# Altium project TIK_HandheldDevice.PrjPcb (part 2 of 2)

## Sheet signal_conditioning_circuit.SchDoc: Piezoelectric sensors conditioning circuit
size A4; Date: 2022-07-29; Author: Juan Del Pino Mena; Revision: 0.6; SheetNumber: 16; SheetTotal: 20; TitleBig: Piezoelectric sensors conditioning circuit; Desc_line1: Two analog signals come from two piezoelectric sensors nailed into a tree or trunk. The way piezos work force us to; Desc_line2: use this circuit to convert charge into voltage. The piezo sensors used generated upto -100 V peak, so it needs clipping
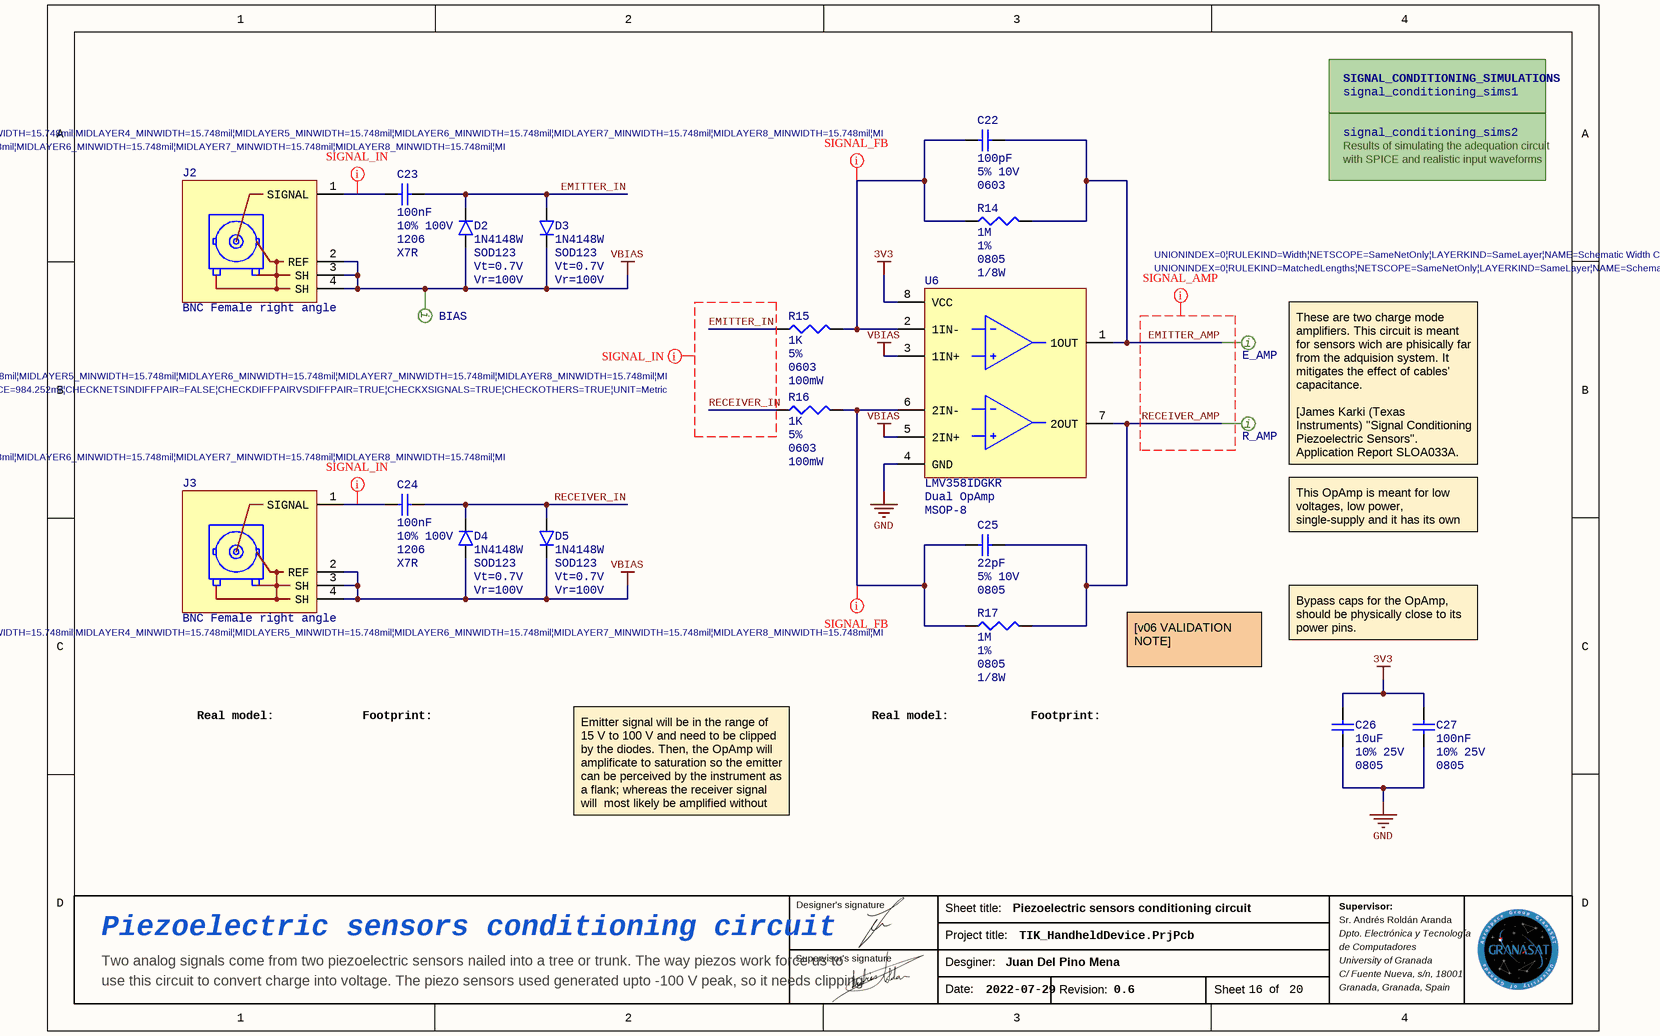
[diagram p9: signal_conditioning_circuit.SchDoc]

### Parts
BIAS  Test Point Pad dual sided  [TEST POINT PAD]  (value not drawn)  (no BOM)
C22  value 100pF  Tolerance: 5% 10V  PackageDescription: 0603  [CAP 0603_1608]  (hidden comment: Cap_cer_0603_100pF_5%)
C23  value 100nF  Tolerance: 10% 100V  PackageDescription: 1206  Type: X7R  [CAP 1206_3216]  (hidden comment: Cap_cer_0805)
C24  value 100nF  Tolerance: 10% 100V  PackageDescription: 1206  Type: X7R  [CAP 1206_3216]  (hidden comment: Cap_cer_0805)
C25  value 22pF  Tolerance: 5% 10V  PackageDescription: 0805  [CAP 0603_1608]  (hidden comment: Cap_cer_0603_22pF_5%)
C26  value 10uF  Tolerance: 10% 25V  PackageDescription: 0805  [CAP 0805_2012]  (hidden comment: Cap_cer_0805)
C27  value 100nF  Tolerance: 10% 25V  PackageDescription: 0805  [CAP 0805_2012]  (hidden comment: Cap_cer_0805)
D2  Part: 1N4148W  PackageDescription: SOD123  ForwardVoltage: Vt=0.7V  ReverseVoltage: Vr=100V  [SOD123F 1N4148W]  (hidden comment: Diode 1N4148W)
D3  Part: 1N4148W  PackageDescription: SOD123  ForwardVoltage: Vt=0.7V  ReverseVoltage: Vr=100V  [SOD123F 1N4148W]  (hidden comment: Diode 1N4148W)
D4  Part: 1N4148W  PackageDescription: SOD123  ForwardVoltage: Vt=0.7V  ReverseVoltage: Vr=100V  [SOD123F 1N4148W]  (hidden comment: Diode 1N4148W)
D5  Part: 1N4148W  PackageDescription: SOD123  ForwardVoltage: Vt=0.7V  ReverseVoltage: Vr=100V  [SOD123F 1N4148W]  (hidden comment: Diode 1N4148W)
E_AMP  Test Point Pad dual sided  [TEST POINT PAD]  (value not drawn)  (no BOM)
J2  Type: BNC Female right angle  [BNC RIGHT ANGLE]  (hidden comment: BNC-Female)
J3  Type: BNC Female right angle  [BNC RIGHT ANGLE]  (hidden comment: BNC-Female)
R14  value 1M  Tolerance: 1%  PackageDescription: 0805  PowerDisipated: 1/8W  [RES 0805_2012]  (hidden comment: Yageo-RC0805FR-072ML)
R15  value 1K  Tolerance: 5%  PackageDescription: 0603  PowerDisipated: 100mW  [RES 0603_1608]  (hidden comment: Res_0603_1K_5%_100mW)
R16  value 1K  Tolerance: 5%  PackageDescription: 0603  PowerDisipated: 100mW  [RES 0603_1608]  (hidden comment: Res_0603_1K_5%_100mW)
R17  value 1M  Tolerance: 1%  PackageDescription: 0805  PowerDisipated: 1/8W  [RES 0805_2012]  (hidden comment: Yageo-RC0805FR-072ML)
R_AMP  Test Point Pad dual sided  [TEST POINT PAD]  (value not drawn)  (no BOM)
U6  Part: LMV358IDGKR  Type: Dual OpAmp  PackageDescription: MSOP-8  [VSSOP-8 DGK (MSOP-8) LMV358]  (hidden comment: IC LMV358DGKR OpAmp)

### Sub-sheets
Designator = signal_conditioning_sims2: no entries
SIGNAL_CONDITIONING_SIMULATIONS = signal_conditioning_sims1: no entries

### Nets
3V3: C26.2 C27.2 U6.8(VCC)
GND: C26.1 C27.1 U6.4(GND)
VBIAS: BIAS.1 D2.1 D3.2 D4.1 D5.2 J2.2(REF) J2.3(SH) J2.4(SH) J3.2(REF) J3.3(SH) J3.4(SH) U6.3(1IN+) U6.5(2IN+)
EMITTER_AMP: C22.2 E_AMP.1 R14.2 U6.1(1OUT)
EMITTER_IN: C23.2 D2.2 D3.1 R15.1
RECEIVER_AMP: C25.2 R17.2 R_AMP.1 U6.7(2OUT)
RECEIVER_IN: C24.2 D4.2 D5.1 R16.1
NetC22_1: C22.1 R14.1 R15.2 U6.2(1IN-)
NetC23_1: C23.1 J2.1(SIGNAL)
NetC24_1: C24.1 J3.1(SIGNAL)
NetC25_1: C25.1 R16.2 R17.1 U6.6(2IN-)

### Layout directives
net class SIGNAL_IN; rule Matched Net Lengths [Tolerance = 25mm]; rule Width Constraint [Pref Width = 0.8mm    Min Width = 0.35mm    Max Width = 0.8mm]: EMITTER_IN, RECEIVER_IN
net class SIGNAL_AMP; rule Matched Net Lengths [Tolerance = 25mm]; rule Width Constraint [Pref Width = 0.8mm    Min Width = 0.35mm    Max Width = 0.8mm]: EMITTER_AMP, RECEIVER_AMP
net class SIGNAL_FB; rule Width Constraint [Pref Width = 0.8mm    Min Width = 0.35mm    Max Width = 0.8mm]: NetC22_1, NetC25_1
net class SIGNAL_IN; rule Width Constraint [Pref Width = 0.8mm    Min Width = 0.35mm    Max Width = 0.8mm]: NetC23_1, NetC24_1

### Notes on the sheet
- Results of simulating the adequation circuit
- with SPICE and realistic input waveforms
- These are two charge mode amplifiers. This circuit is meant for sensors wich are phisically far from the adquision system. It mitigates the effect of cables' capacitance.
  [James Karki (Texas Instruments) "Signal Conditioning Piezoelectric Sensors". Application Report SLOA033A. September 2000]
- This OpAmp is meant for low voltages, low power, single-supply and it has its own ESD protection.
- Bypass caps for the OpAmp, should be physically close to its power pins.
- Real model:
- Footprint:
- [v06 VALIDATION NOTE]
  UNTESTED
- Emitter signal will be in the range of 15 V to 100 V and need to be clipped by the diodes. Then, the OpAmp will amplificate to saturation so the emitter can be perceived by the instrument as a flank; whereas the receiver signal will  most likely be amplified without any clipping.
- Designer's signature
- Sheet title:
- Sr. Andrés Roldán Aranda
- Supervisor:
- Supervisor's signature
- Project title:
- Desginer:
- Dpto. Electrónica y Tecnología
- de Computadores
- University of Granada
- C/ Fuente Nueva, s/n, 18001
- Granada, Granada, Spain
- Date:
- Revision:
- Sheet
- of
- (in symbol Test Point Pad dual sided) i

### Library data of the parts
BIAS E_AMP R_AMP = Test Point Pad dual sided: Test point - PCB Pad dual sided
C22 = Cap_cer_0603_100pF_5%: Ceramic cap size 0805
C23 C24 = Cap_cer_1206_100nF_100V_10%: Ceramic cap size 1206 C1206C104K1RACTU
C25 = Cap_cer_0603_22pF_5%: Ceramic cap size 0805
C26 = Cap_cer_0805_10uF_10%: Ceramic cap size 0805; FabGroup: Signal conditioning; FabOrder: 13
C27 = Cap_cer_0805_100nF_10%: Ceramic cap size 0805; FabGroup: Signal conditioning; FabOrder: 13
D2-D5 = Diode 1N4148W: SURFACE MOUNT FAST SWITCHING DIODE; Type: Rectifier, General purpose; FabGroup: Signal conditioning; FabOrder: 13
J2 J3 = CON BNC Female Socket: BNC coaxial female connector
R14 R17 = Res_0805_1M_1%: Res size 0805 SMD mounting, low power. / Yageo-RC0805FR-071ML
R15 R16 = Res_0603_1K_5%_100mW: Res size 0603 SMD mounting, low power
U6 = IC LMV358DGKR OpAmp: LMV358IDGKR Dual OpAmp; low voltage rail to rail opamp; 2.7V to 5V Vss; ESD protection; MSOP-8 Package.

## Sheet signal_conditioning_sims1.SchDoc: Signal conditioning simulations. 1 of 2
size A4; Date: 2022-07-29; Author: Juan Del Pino Mena; Revision: 0.6; SheetNumber: 17; SheetTotal: 21; TitleBig: Signal conditioning circuit simulations; Desc_line1: SPICE simulations of the adequation circuit. These are only the results. You can find the simulation circuit and models; Desc_line2: on the ./SIMULATIONS/ folder inside this project.
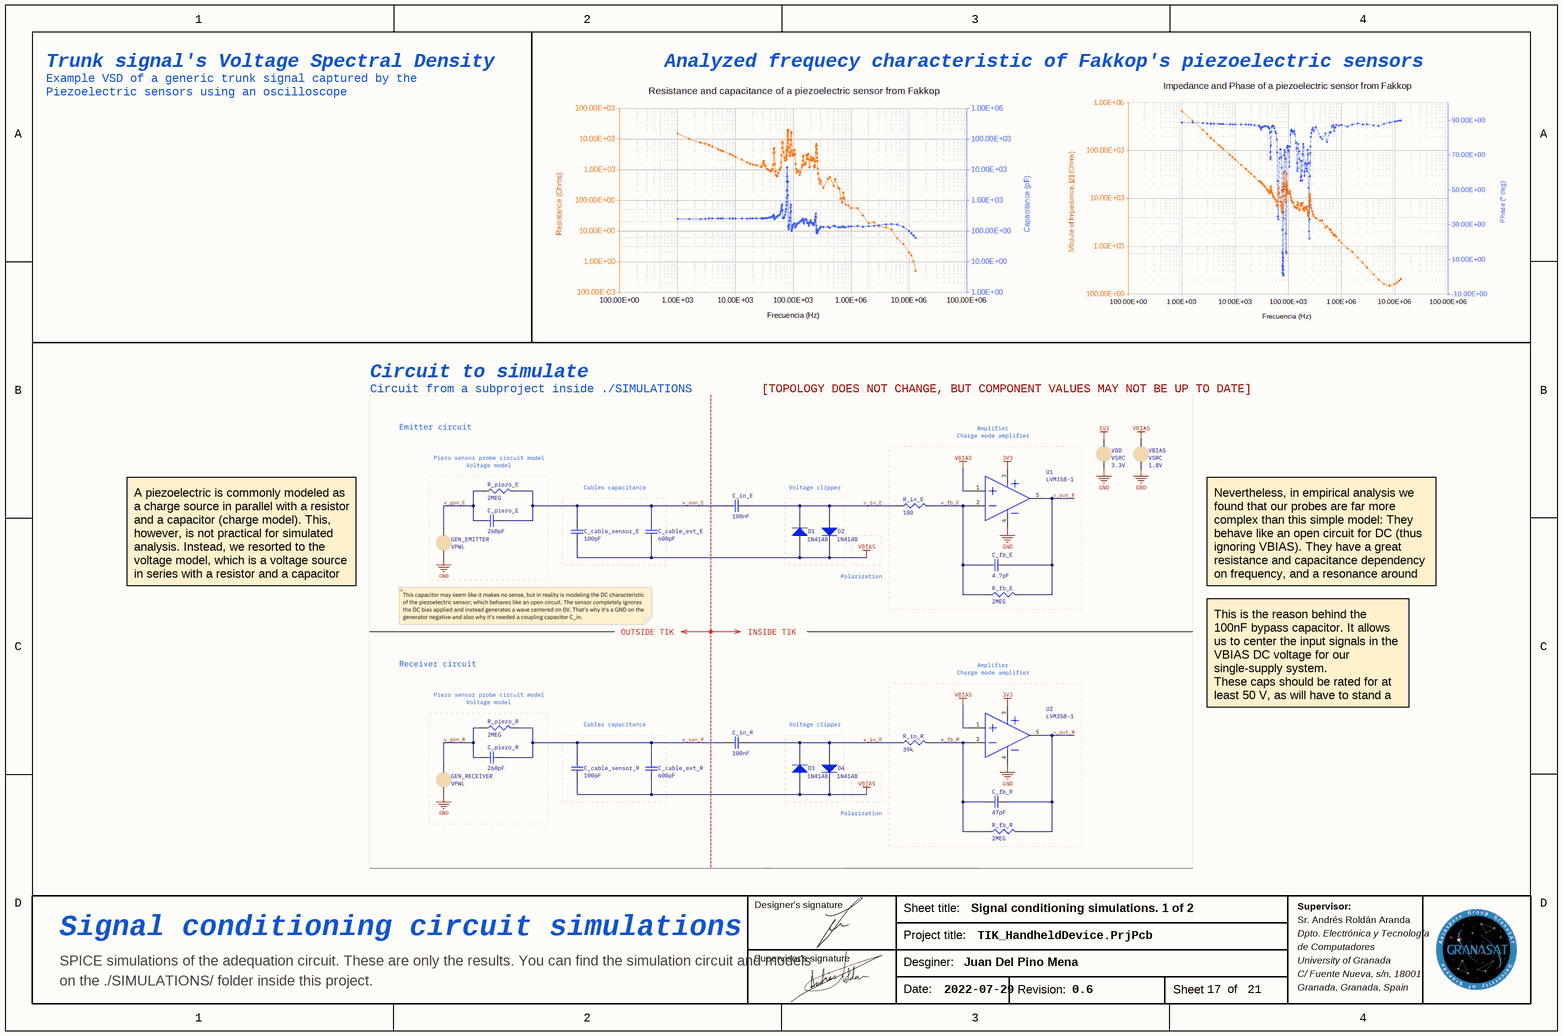
[diagram p10: signal_conditioning_sims1.SchDoc]

### Notes on the sheet
- Trunk signal's Voltage Spectral Density
- Example VSD of a generic trunk signal captured by the
- Piezoelectric sensors using an oscilloscope
- Analyzed frequecy characteristic of Fakkop's piezoelectric sensors
- Circuit to simulate
- Circuit from a subproject inside ./SIMULATIONS
- [TOPOLOGY DOES NOT CHANGE, BUT COMPONENT VALUES MAY NOT BE UP TO DATE]
- A piezoelectric is commonly modeled as a charge source in parallel with a resistor and a capacitor (charge model). This, however, is not practical for simulated analysis. Instead, we resorted to the voltage model, which is a voltage source in series with a resistor and a capacitor in parallel.
- Nevertheless, in empirical analysis we found that our probes are far more complex than this simple model: They behave like an open circuit for DC (thus ignoring VBIAS). They have a great resistance and capacitance dependency on frequency, and a resonance around 100 kHz.
- This is the reason behind the 100nF bypass capacitor. It allows us to center the input signals in the VBIAS DC voltage for our single-supply system.
  These caps should be rated for at least 50 V, as will have to stand a big voltage peak on their extremes.
- Designer's signature
- Sheet title:
- Sr. Andrés Roldán Aranda
- Supervisor:
- Supervisor's signature
- Project title:
- Desginer:
- Dpto. Electrónica y Tecnología
- de Computadores
- University of Granada
- C/ Fuente Nueva, s/n, 18001
- Granada, Granada, Spain
- Date:
- Revision:
- Sheet
- of

## Sheet signal_conditioning_sims2.SchDoc: Signal conditioning simulations. 2 of 2
size A4; Date: 2022-07-29; Author: Juan Del Pino Mena; SheetNumber: 18; SheetTotal: 21; TitleBig: Signal conditioning circuit simulations; Desc_line1: SPICE simulations of the adequation circuit. These are only the results. You can find the simulation circuit and models; Desc_line2: on the ./SIMULATIONS/ folder inside this project.
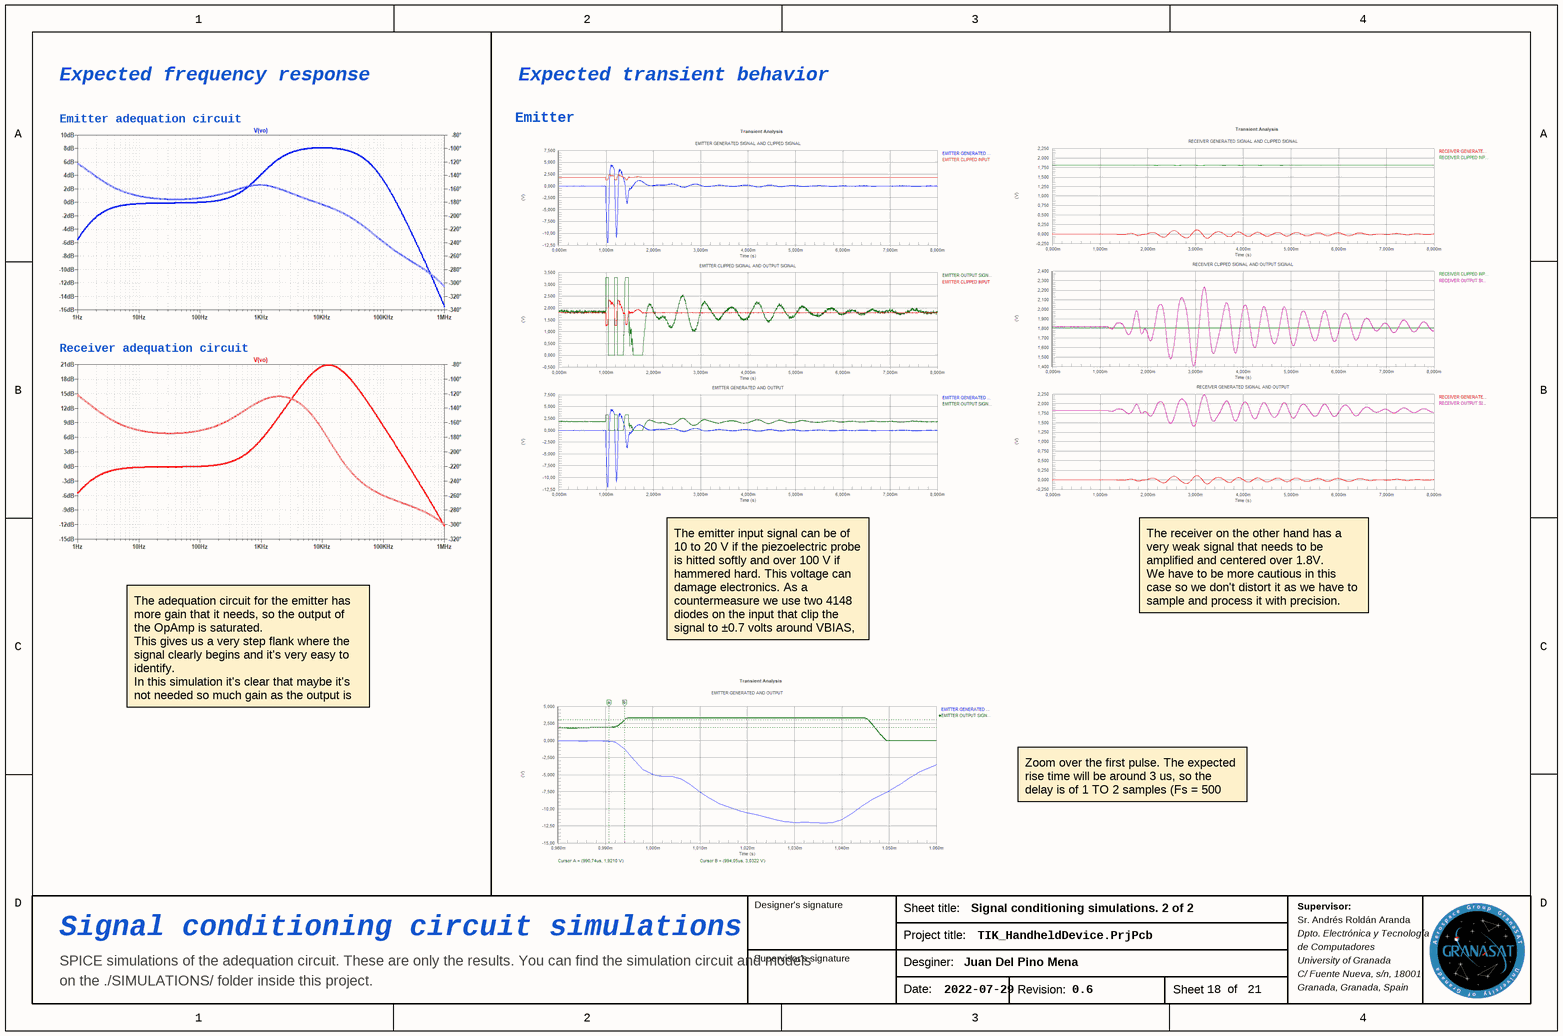
[diagram p11: signal_conditioning_sims2.SchDoc]

### Notes on the sheet
- Expected frequency response
- Expected transient behavior
- Emitter adequation circuit
- Emitter
- Receiver adequation circuit
- The emitter input signal can be of 10 to 20 V if the piezoelectric probe is hitted softly and over 100 V if hammered hard. This voltage can damage electronics. As a countermeasure we use two 4148 diodes on the input that clip the signal to ±0.7 volts around VBIAS, allowing us to manipulate it without risk.
- The receiver on the other hand has a very weak signal that needs to be amplified and centered over 1.8V.
  We have to be more cautious in this case so we don't distort it as we have to sample and process it with precision.
- The adequation circuit for the emitter has more gain that it needs, so the output of the OpAmp is saturated.
  This gives us a very step flank where the signal clearly begins and it's very easy to identify.
  In this simulation it's clear that maybe it's not needed so much gain as the output is very noisy and could be easily false-triggered.
- Zoom over the first pulse. The expected rise time will be around 3 us, so the delay is of 1 TO 2 samples (Fs = 500 kHz)
- Designer's signature
- Sheet title:
- Sr. Andrés Roldán Aranda
- Supervisor:
- Supervisor's signature
- Project title:
- Desginer:
- Dpto. Electrónica y Tecnología
- de Computadores
- University of Granada
- C/ Fuente Nueva, s/n, 18001
- Granada, Granada, Spain
- Date:
- Revision:
- Sheet
- of

## Sheet battery_and_current_sense.SchDoc: Battery and current sense
size A4; Date: 2022-07-29; SheetNumber: 8; SheetTotal: 20; TitleBig: Battery and current sense; Desc_line1: Two circuit variants that will be implemented but not used simultaneously. The usage of one over the other will come; Desc_line2: by component disponibility. INA219 current sensor is independent and common for both systems.
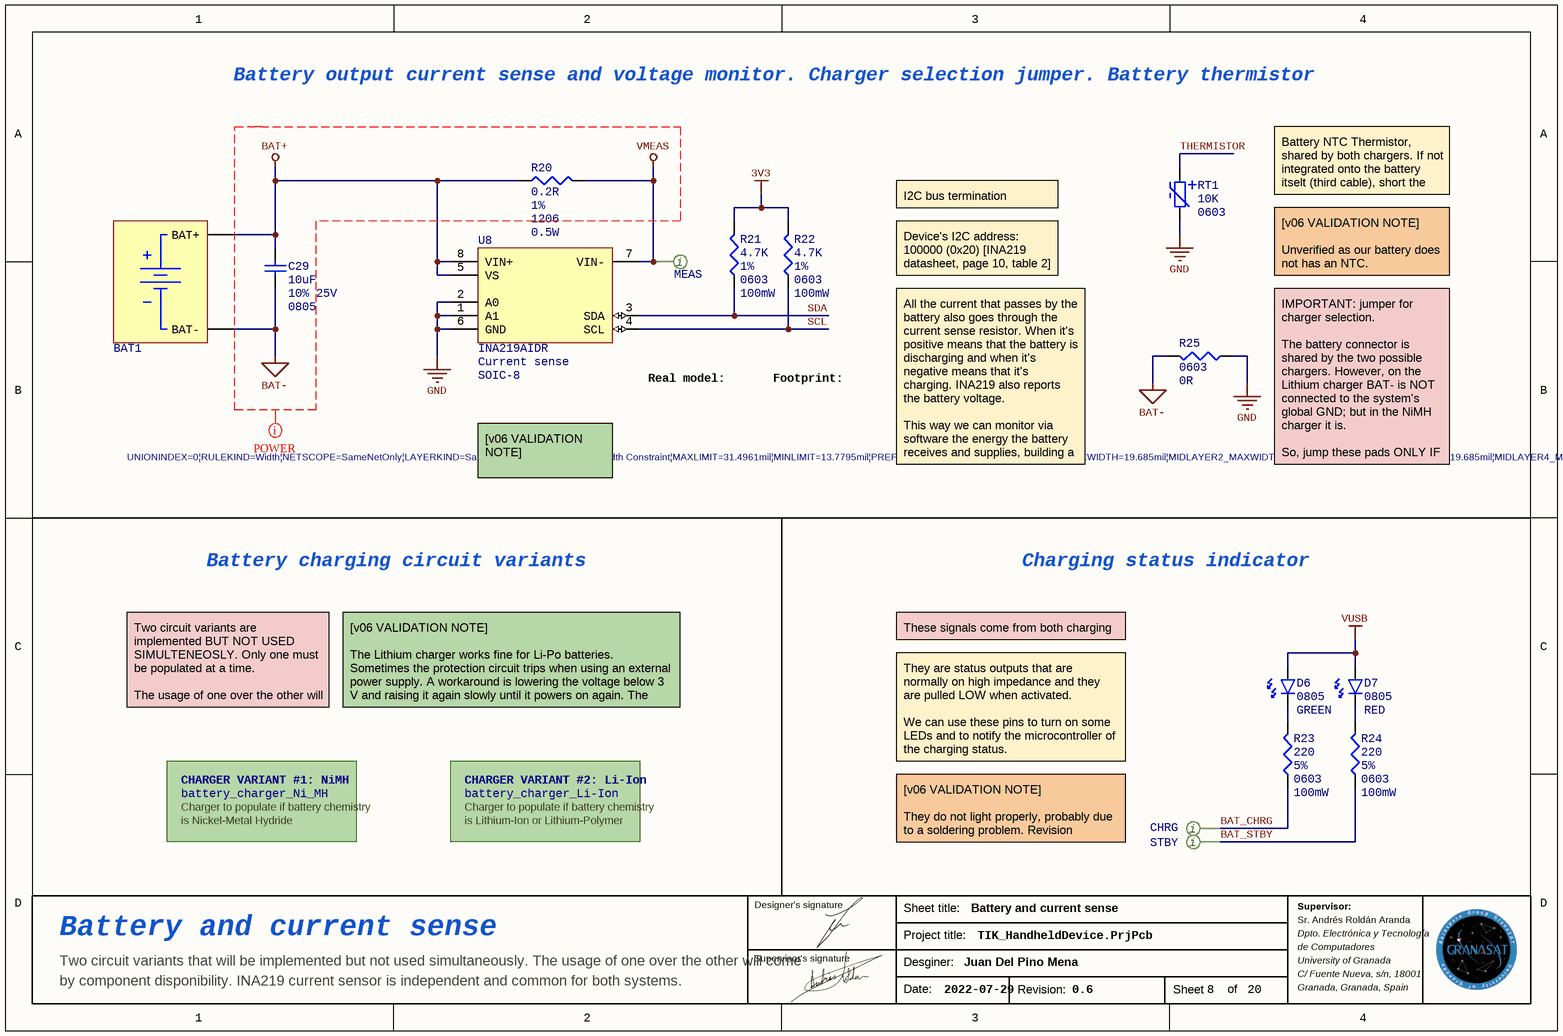
[diagram p12: battery_and_current_sense.SchDoc]

### Parts
BAT1  Battery pads  [BATTERY_PADS]  (value not drawn)  (no BOM)
C29  value 10uF  Tolerance: 10% 25V  PackageDescription: 0805  [CAP 0805_2012]  (hidden comment: Cap_cer_0805)
CHRG  Test Point Pad dual sided  [TEST POINT PAD]  (value not drawn)  (no BOM)
D6  PackageDescription: 0805  Type: GREEN  [LED 0805_2012 GREEN]  (hidden comment: Diode LED_G_0805)
D7  PackageDescription: 0805  Type: RED  [LED 0805_2012 RED]  (hidden comment: Diode LED_R_0805)
MEAS  Test Point Pad dual sided  [TEST POINT PAD]  (value not drawn)  (no BOM)
R20  value 0.2R  Tolerance: 1%  PackageDescription: 1206  PowerDisipated: 0.5W  [RES 1206_3216]  (hidden comment: sense)
R21  value 4.7K  Tolerance: 1%  PackageDescription: 0603  PowerDisipated: 100mW  [RES 0603_1608]  (hidden comment: Res_0603_4.7K_1%_100mW)
R22  value 4.7K  Tolerance: 1%  PackageDescription: 0603  PowerDisipated: 100mW  [RES 0603_1608]  (hidden comment: Res_0603_4.7K_1%_100mW)
R23  value 220  Tolerance: 5%  PackageDescription: 0603  PowerDisipated: 100mW  [RES 0603_1608]  (hidden comment: Res_0603_220_5%_100mW)
R24  value 220  Tolerance: 5%  PackageDescription: 0603  PowerDisipated: 100mW  [RES 0603_1608]  (hidden comment: Res_0603_220_5%_100mW)
R25  value 0R  PackageDescription: 0603  [RES 0603_1608]  (hidden comment: Res_0603_0ohm)
RT1  value 10K  PackageDescription: 0603  [NTC THT ver]  (hidden comment: NTC 10K tht)
STBY  Test Point Pad dual sided  [TEST POINT PAD]  (value not drawn)  (no BOM)
U8  Part: INA219AIDR  Type: Current sense  PackageDescription: SOIC-8  [SOIC-8-D0008A INA219D]  (hidden comment: INA219)

### Sub-sheets
CHARGER VARIANT #1: NiMH = battery_charger_Ni_MH: no entries
CHARGER VARIANT #2: Li-Ion = battery_charger_Li-Ion: no entries

### Nets
3V3: R21.2 R22.2
BAT+: BAT1.2(BAT+) C29.2 R20.1 U8.5(VS) U8.8(VIN+)
BAT-: BAT1.1(BAT-) C29.1 R25.2
GND: R25.1 RT1.2 U8.1(A1) U8.2(A0) U8.6(GND)
VMEAS: MEAS.1 R20.2 U8.7(VIN-)
VUSB: D6.1 D7.1
BAT_CHRG: CHRG.1 R23.1
BAT_STBY: R24.1 STBY.1
SCL: R22.1 U8.4(SCL)
SDA: R21.1 U8.3(SDA)
THERMISTOR: RT1.1
NetD6_2: D6.2 R23.2
NetD7_2: D7.2 R24.2

### Layout directives
net class POWER; rule Width Constraint [Pref Width = 0.5mm    Min Width = 0.35mm    Max Width = 0.8mm]: BAT+, BAT-, VMEAS

### Notes on the sheet
- Battery output current sense and voltage monitor. Charger selection jumper. Battery thermistor
- I2C bus termination resistors
- Battery NTC Thermistor, shared by both chargers. If not integrated onto the battery itselt (third cable), short the pads.
- Device's I2C address: 100000 (0x20) [INA219 datasheet, page 10, table 2]
- [v06 VALIDATION NOTE]
  Unverified as our battery does not has an NTC.
- (near U8) Real model:
- Footprint:
- [v06 VALIDATION NOTE]
  Works correctly.
- All the current that passes by the battery also goes through the current sense resistor. When it's positive means that the battery is discharging and when it's negative means that it's charging. INA219 also reports the battery voltage.
  This way we can monitor via software the energy the battery receives and supplies, building a BMS (Battery Monitoring System)
- IMPORTANT: jumper for charger selection.
  The battery connector is shared by the two possible chargers. However, on the Lithium charger BAT- is NOT connected to the system's global GND; but in the NiMH charger it is.
  So, jump these pads ONLY IF USING THE NiMH charger.
- Battery charging circuit variants
- Charging status indicator
- These signals come from both charging IC's.
- Two circuit variants are implemented BUT NOT USED SIMULTENEOSLY. Only one must be populated at a time.
  The usage of one over the other will come by component disponibility.
- [v06 VALIDATION NOTE]
  The Lithium charger works fine for Li-Po batteries. Sometimes the protection circuit trips when using an external power supply. A workaround is lowering the voltage below 3 V and raising it again slowly until it powers on again. The Ni-MH charger remains untested.
- They are status outputs that are normally on high impedance and they are pulled LOW when activated.
  We can use these pins to turn on some LEDs and to notify the microcontroller of the charging status.
- Charger to populate if battery chemistry
- is Nickel-Metal Hydride
- is Lithium-Ion or Lithium-Polymer
- [v06 VALIDATION NOTE]
  They do not light properly, probably due to a soldering problem. Revision pending.
- Designer's signature
- Sheet title:
- Sr. Andrés Roldán Aranda
- Supervisor:
- Supervisor's signature
- Project title:
- Desginer:
- Dpto. Electrónica y Tecnología
- de Computadores
- University of Granada
- C/ Fuente Nueva, s/n, 18001
- Granada, Granada, Spain
- Date:
- Revision:
- Sheet
- of
- (in symbol Test Point Pad dual sided) i

### Library data of the parts
BAT1 = Battery pads: Generic 2-Pad battery connector
C29 = Cap_cer_0805_10uF_10%: Ceramic cap size 0805; FabGroup: Battery; FabOrder: 7
CHRG MEAS STBY = Test Point Pad dual sided: Test point - PCB Pad dual sided
D6 = Diode LED_G_0805: Low power LED color Green; FabGroup: Charging status; FabOrder: 5
D7 = Diode LED_R_0805: Low power LED color Red; FabGroup: Charging status; FabOrder: 5
R20 = Res_1206_0R2_1%_500mW: Res size 1206 SMD mounting, high power, shunt, current sense.
R21 R22 = Res_0603_4.7K_1%_100mW: Res size 0603 SMD mounting, low power
R23 R24 = Res_0603_220_5%_100mW: Res size 0603 SMD mounting, low power
R25 = Res_0603_0ohm: Res size 0603 SMD mounting, zero-ohm 0R Yageo RC0603JR-070RL; Tolerance: 5%; PowerDisipated: 100mW; FabGroup: Battery; FabOrder: 7
RT1 = NTC 10K tht: NTC THERMISTOR 10K for solding a cable from the battery NTC
U8 = IC INA219 current sense: Zero-Drift, Bi-Directional CURRENT/POWER MONITOR with I2C. SOIC-8 (D) Package

## Sheet battery_charger_ni_mh.SchDoc: Battery charger
size A4; Date: 2022-07-29; Author: Juan Del Pino Mena; Revision: 0.6; SheetNumber: 9; SheetTotal: 20; TitleBig: Battery charging circuitry for Ni-MH; Desc_line1: Battery charger circuit variant #1. By default the device uses a Nickel-metal hydride battery which are chemically and; Desc_line2: thermally more stable (and safer) than Lithium-based ones; at the cost of a lower charge/volume ratio.
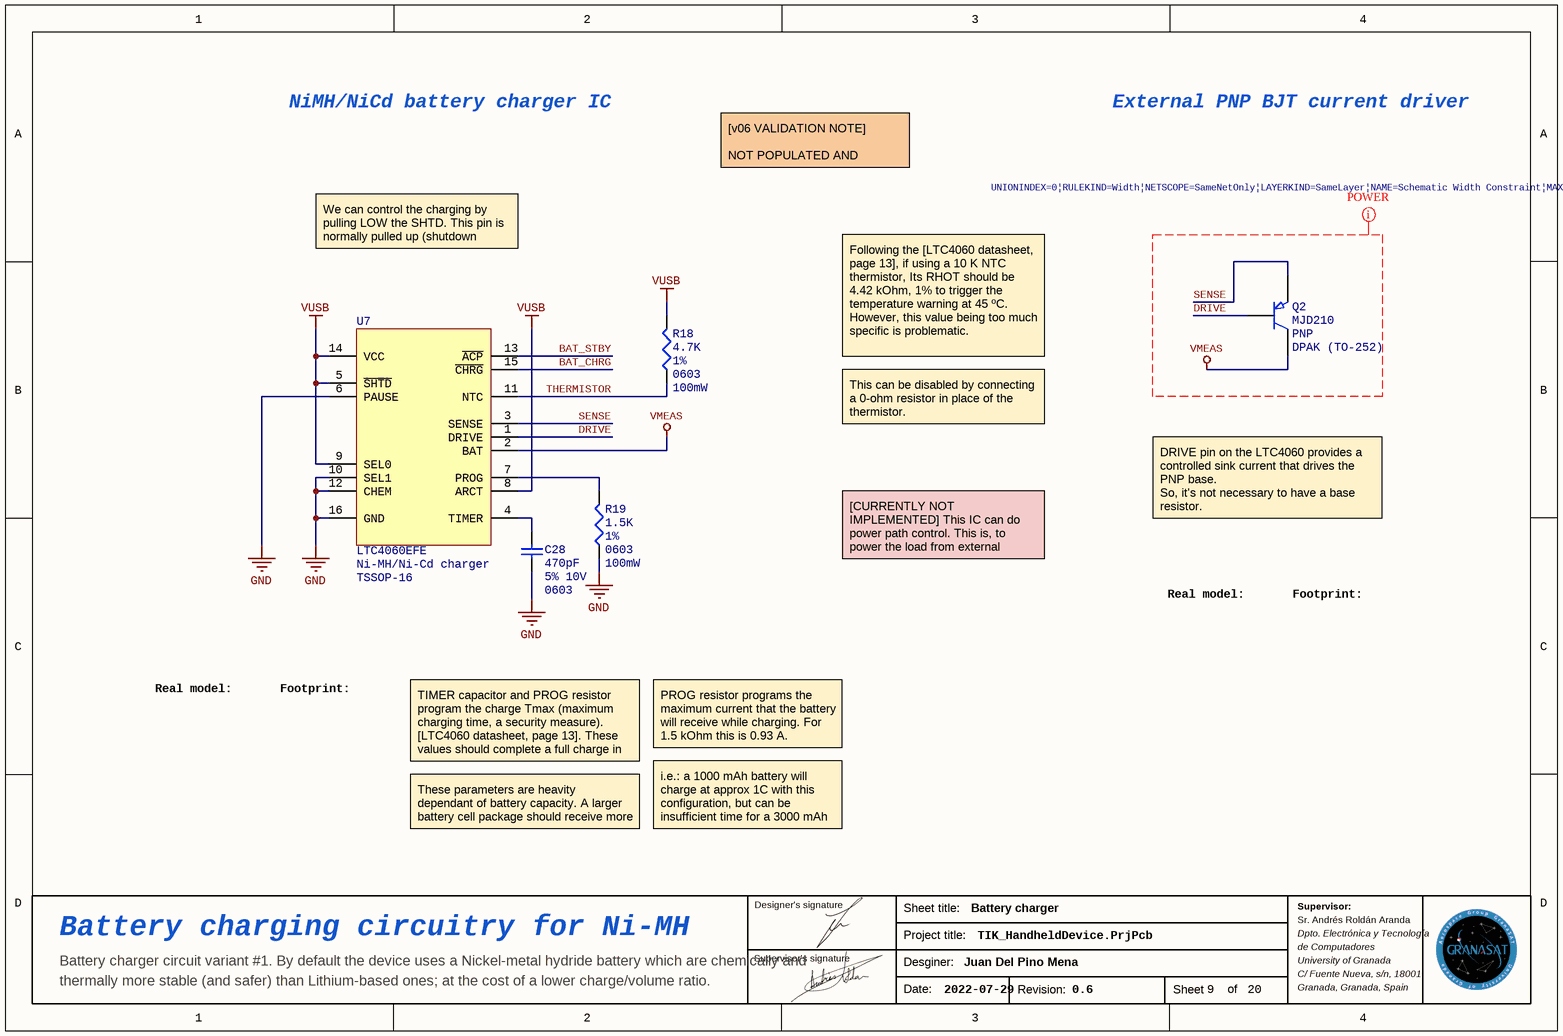
[diagram p13: battery_charger_ni_mh.SchDoc]

### Parts
C28  value 470pF  Tolerance: 5% 10V  PackageDescription: 0603  [CAP 0603_1608]  (hidden comment: Cap_cer_0603_470pF_5%)
Q2  Part: MJD210  Type: PNP  PackageDescription: DPAK (TO-252)  [DPAK TO-252 MJD210]  (hidden comment: PNP BJT MJD210 transistor)
R18  value 4.7K  Tolerance: 1%  PackageDescription: 0603  PowerDisipated: 100mW  [RES 0603_1608]  (hidden comment: Res_0603_4.7K_1%_100mW)
R19  value 1.5K  Tolerance: 1%  PackageDescription: 0603  PowerDisipated: 100mW  [RES 0603_1608]  (hidden comment: Res_0603_1.5K_1%_100mW)
U7  PackageDescription: TSSOP-16  Desc: Ni-MH/Ni-Cd charger  [TSSOP-16 LTC4060EFE]  (hidden comment: IC LTC4060EFE Bat NiMH charger)

### Nets
GND: C28.1 R19.1 U7.6(PAUSE) U7.10(SEL1) U7.12(CHEM) U7.16(GND)
VMEAS: Q2.4(C) U7.2(BAT)
VUSB: R18.2 U7.5(~{SHTD}) U7.8(ARCT) U7.9(SEL0) U7.14(VCC)
BAT_CHRG: U7.15(~{CHRG})
BAT_STBY: U7.13(~{ACP})
DRIVE: Q2.1(B) U7.1(DRIVE)
SENSE: Q2.3(E) U7.3(SENSE)
THERMISTOR: R18.1 U7.11(NTC)
NetC28_2: C28.2 U7.4(TIMER)
NetR19_2: R19.2 U7.7(PROG)

### Layout directives
net class POWER; rule Width Constraint [Pref Width = 0.5mm    Min Width = 0.35mm    Max Width = 0.8mm]: DRIVE, SENSE, VMEAS

### Notes on the sheet
- NiMH/NiCd battery charger IC
- External PNP BJT current driver
- [v06 VALIDATION NOTE]
  NOT POPULATED AND UNTESTED.
- We can control the charging by pulling LOW the SHTD. This pin is normally pulled up (shutdown disabled).
- Following the [LTC4060 datasheet, page 13], if using a 10 K NTC thermistor, Its RHOT should be 4.42 kOhm, 1% to trigger the temperature warning at 45 ºC.
  However, this value being too much specific is problematic.
- This can be disabled by connecting a 0-ohm resistor in place of the thermistor.
- DRIVE pin on the LTC4060 provides a controlled sink current that drives the PNP base.
  So, it's not necessary to have a base resistor.
- [CURRENTLY NOT IMPLEMENTED] This IC can do power path control. This is, to power the load from external source while charging the battery.
- Real model:
- Footprint:
- TIMER capacitor and PROG resistor program the charge Tmax (maximum charging time, a security measure). [LTC4060 datasheet, page 13]. These values should complete a full charge in at most 1 h 6'
- PROG resistor programs the maximum current that the battery will receive while charging. For 1.5 kOhm this is 0.93 A.
- These parameters are heavity dependant of battery capacity. A larger battery cell package should receive more time / current.
- i.e.: a 1000 mAh battery will charge at approx 1C with this configuration, but can be insufficient time for a 3000 mAh one.
- Designer's signature
- Sheet title:
- Sr. Andrés Roldán Aranda
- Supervisor:
- Supervisor's signature
- Project title:
- Desginer:
- Dpto. Electrónica y Tecnología
- de Computadores
- University of Granada
- C/ Fuente Nueva, s/n, 18001
- Granada, Granada, Spain
- Date:
- Revision:
- Sheet
- of

### Library data of the parts
C28 = Cap_cer_0603_470pF_5%: Ceramic cap size 0805; FabGroup: Charger for Ni-MH; FabOrder: 6
Q2 = PNP BJT MJD210 transistor: MJD210 PNP BJT transistor DPAK (decawatt) 5A dc
R18 = Res_0603_4.7K_1%_100mW: Res size 0603 SMD mounting, low power
R19 = Res_0603_1.5K_1%_100mW: Res size 0603 SMD mounting, low power
U7 = IC LTC4060EFE Bat NiMH charger: LTC4060EFE; Part: LTC4060EFE

## Sheet battery_charger_li-ion.SchDoc: Battery charger
size A4; Date: 2022-07-29; Author: Juan Del Pino Mena; Revision: 0.6; SheetNumber: 10; SheetTotal: 20; TitleBig: Battery charging circuitry for Li-Po & Li-Ion; Desc_line1: Battery charger circuit variant #2. Li-Ion and Li-Po batteries offer much more power density at the cost of inestability.; Desc_line2: This circuit must NOT be placed if the Ni-MH charger is present on the board (and vice-versa).
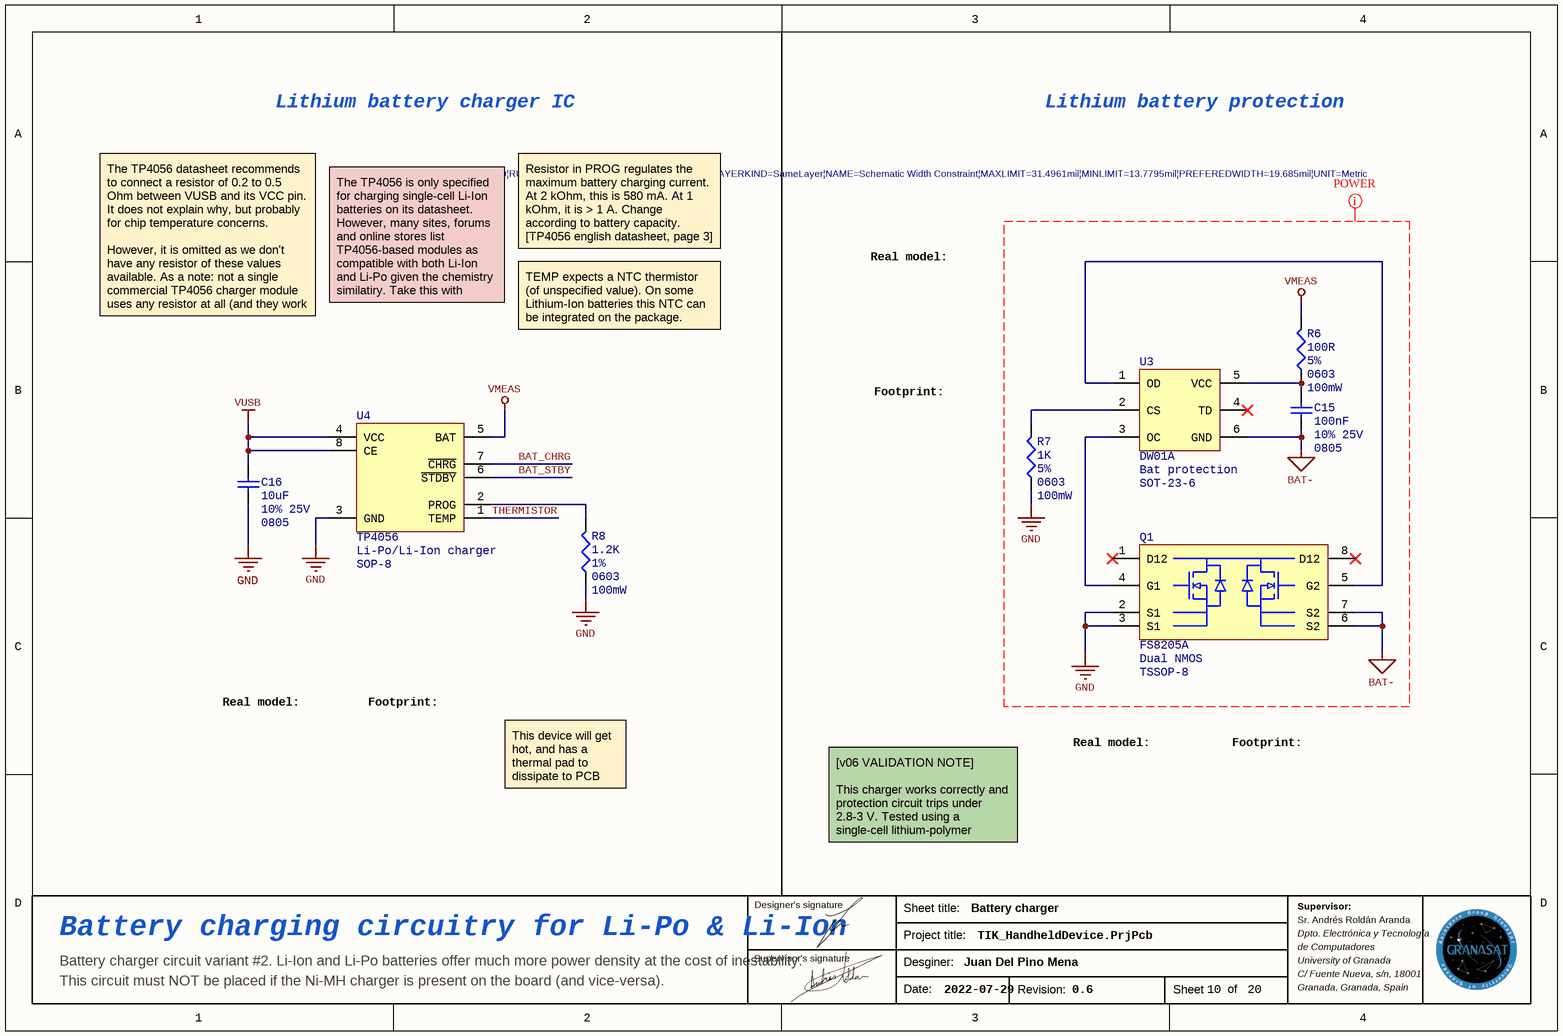
[diagram p14: battery_charger_li-ion.SchDoc]

### Parts
C15  value 100nF  Tolerance: 10% 25V  PackageDescription: 0805  [CAP 0805_2012]  (hidden comment: Cap_cer_0805)
C16  value 10uF  Tolerance: 10% 25V  PackageDescription: 0805  [CAP 0805_2012]  (hidden comment: Cap_cer_0805)
Q1  Type: Dual NMOS  PackageDescription: TSSOP-8  [TSSOP-8 FS8205A]  (hidden comment: FS8205A)
R6  value 100R  Tolerance: 5%  PackageDescription: 0603  PowerDisipated: 100mW  [RES 0603_1608]  (hidden comment: Res_0603_100R_5%_100mW)
R7  value 1K  Tolerance: 5%  PackageDescription: 0603  PowerDisipated: 100mW  [RES 0603_1608]  (hidden comment: Res_0603_1K_5%_100mW)
R8  value 1.2K  Tolerance: 1%  PackageDescription: 0603  PowerDisipated: 100mW  [RES 0603_1608]  (hidden comment: Res_0603_1.2K_1%_100mW)
U3  Type: Bat protection  PackageDescription: SOT-23-6  [SOT-23-6 DW01A]  (hidden comment: DW01A)
U4  Type: Li-Po/Li-Ion charger  PackageDescription: SOP-8  [SOIC-8-D0008A TP4056]  (hidden comment: TP4056)

### Nets
BAT-: C15.1 Q1.6(S2) Q1.7(S2) U3.6(GND)
GND: C16.1 Q1.2(S1) Q1.3(S1) R7.1 R8.1 U4.3(GND)
VMEAS: R6.2 U4.5(BAT)
VUSB: C16.2 U4.4(VCC) U4.8(CE)
BAT_CHRG: U4.7(~{CHRG})
BAT_STBY: U4.6(~{STDBY})
THERMISTOR: U4.1(TEMP)
NetC15_2: C15.2 R6.1 U3.5(VCC)
NetQ1_4: Q1.4(G1) U3.3(OC)
NetQ1_5: Q1.5(G2) U3.1(OD)
NetR7_2: R7.2 U3.2(CS)
NetR8_2: R8.2 U4.2(PROG)

Not connected (* = marked no-connect by the designer): Q1 1(D12)* 8(D12)*; U3 4(TD)*

### Layout directives
net class POWER; rule Width Constraint [Pref Width = 0.5mm    Min Width = 0.35mm    Max Width = 0.8mm]: BAT-, GND, VMEAS

### Notes on the sheet
- Lithium battery charger IC
- Lithium battery protection
- Resistor in PROG regulates the maximum battery charging current. At 2 kOhm, this is 580 mA. At 1 kOhm, it is > 1 A. Change according to battery capacity. [TP4056 english datasheet, page 3]
- The TP4056 datasheet recommends to connect a resistor of 0.2 to 0.5 Ohm between VUSB and its VCC pin. It does not explain why, but probably for chip temperature concerns.
  However, it is omitted as we don't have any resistor of these values available. As a note: not a single commercial TP4056 charger module uses any resistor at all (and they work fine at higher charge rates).
- The TP4056 is only specified for charging single-cell Li-Ion batteries on its datasheet. However, many sites, forums and online stores list TP4056-based modules as compatible with both Li-Ion and Li-Po given the chemistry similatiry. Take this with caution.
- Real model:
- TEMP expects a NTC thermistor (of unspecified value). On some Lithium-Ion batteries this NTC can be integrated on the package.
- Footprint:
- This device will get hot, and has a thermal pad to dissipate to PCB GND plane
- [v06 VALIDATION NOTE]
  This charger works correctly and protection circuit trips under 2.8-3 V. Tested using a single-cell lithium-polymer battery.
- Designer's signature
- Sheet title:
- Sr. Andrés Roldán Aranda
- Supervisor:
- Supervisor's signature
- Project title:
- Desginer:
- Dpto. Electrónica y Tecnología
- de Computadores
- University of Granada
- C/ Fuente Nueva, s/n, 18001
- Granada, Granada, Spain
- Date:
- Revision:
- Sheet
- of

### Library data of the parts
C15 = Cap_cer_0805_100nF_10%: Ceramic cap size 0805; FabGroup: Charger for Li-Ion; FabOrder: 4
C16 = Cap_cer_0805_10uF_10%: Ceramic cap size 0805; FabGroup: Charger for Li-Ion; FabOrder: 4
Q1 = IC FS8205A Dual NMOS: Dual N-channel Enhancement mode power MOSFET; ComponentLink1Description: New link; ComponentLink1URL: *; Part: FS8205A
R6 = Res_0603_100R_5%_100mW: Res size 0603 SMD mounting, low power
R7 = Res_0603_1K_5%_100mW: Res size 0603 SMD mounting, low power
R8 = Res_0603_1.2K_1%_100mW: Res size 0603 SMD mounting, low power
U3 = IC DW01A bat protection: DW01A One cell Li-Po/Li-ion Battery protection IC; FabGroup: Charger for Li-Ion; FabOrder: 4; Part: DW01A
U4 = IC TP4056 BAT Charger: 1A Standalone Linear Li-lon Battery Charger with Thermal Regulation in SOP-8; Part: TP4056

## Sheet programming.SchDoc: USB to UART and MCU programming
size A4; SheetNumber: 12; SheetTotal: 20; TitleBig: USB to UART and MCU programming; Desc_line1: This circuit allows a computer to the ESP32 via USB so it can be reprogrammed. This is possible by sending RTS; Desc_line2: and DTR signals with a determined timing so the device enters an alternative boot mode.
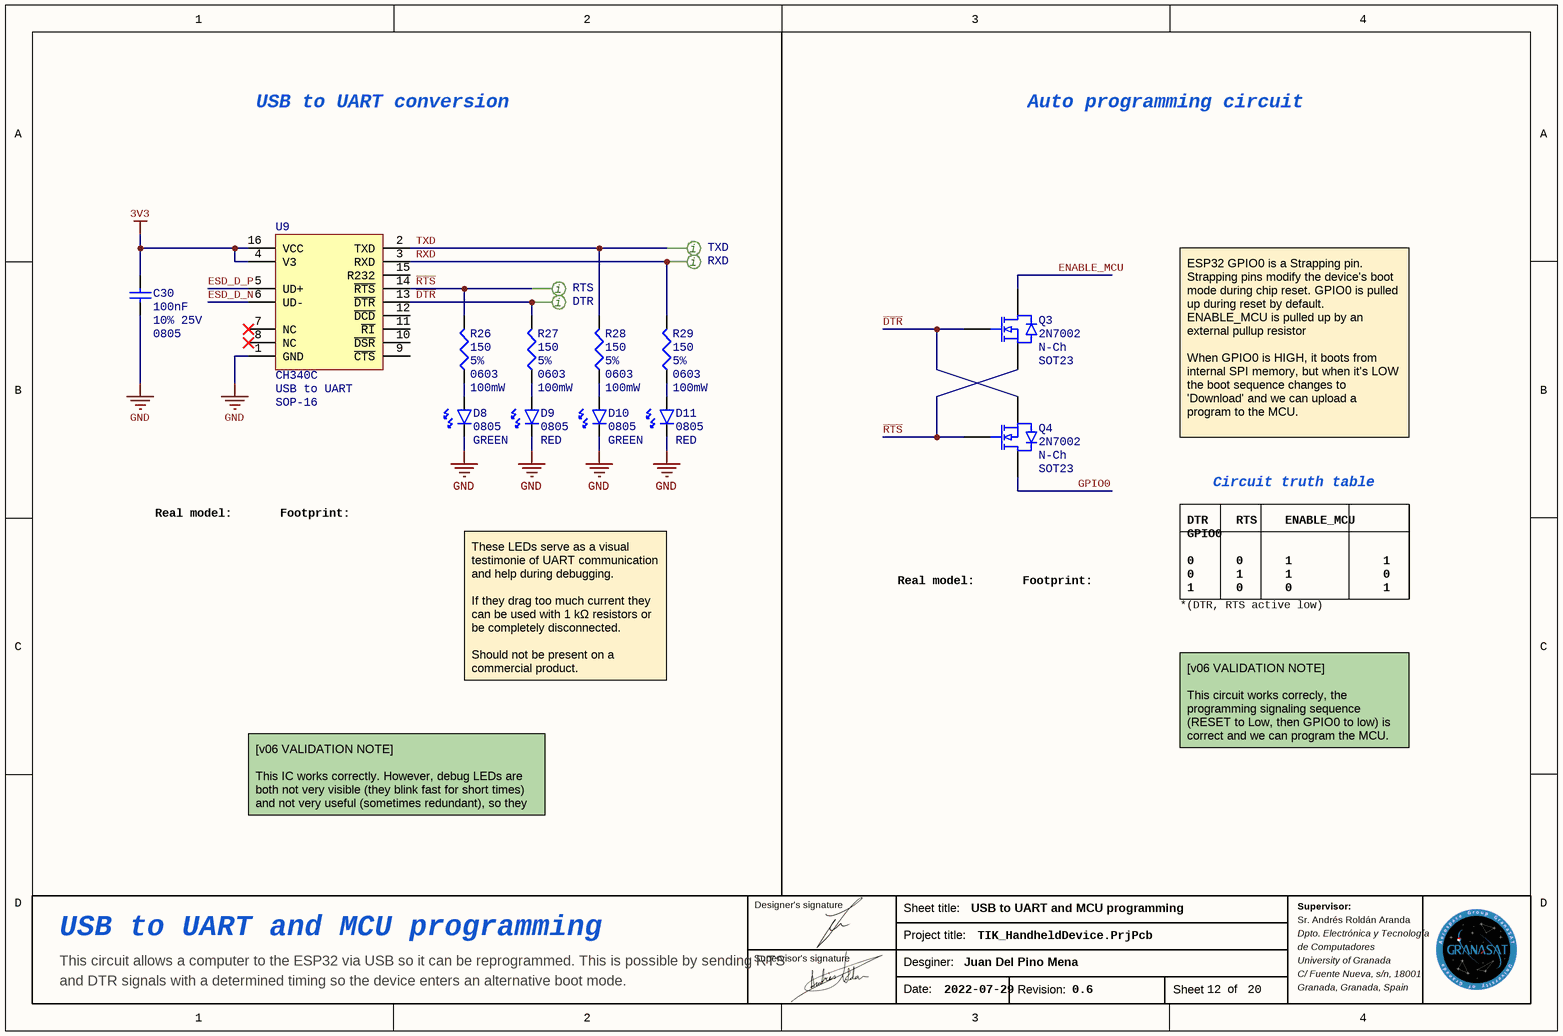
[diagram p15: programming.SchDoc]

### Parts
C30  value 100nF  Tolerance: 10% 25V  PackageDescription: 0805  [CAP 0805_2012]  (hidden comment: Cap_cer_0805)
D8  PackageDescription: 0805  Type: GREEN  [LED 0805_2012 GREEN]  (hidden comment: Diode LED_G_0805)
D9  PackageDescription: 0805  Type: RED  [LED 0805_2012 RED]  (hidden comment: Diode LED_R_0805)
D10  PackageDescription: 0805  Type: GREEN  [LED 0805_2012 GREEN]  (hidden comment: Diode LED_G_0805)
D11  PackageDescription: 0805  Type: RED  [LED 0805_2012 RED]  (hidden comment: Diode LED_R_0805)
DTR  Test Point Pad dual sided  [TEST POINT PAD]  (value not drawn)  (no BOM)
Q3  Part: 2N7002  Type: N-Ch  PackageDescription: SOT23  [SOT-23-3 TO-236AB 2N7002]  (hidden comment: NMOS 2N7002)
Q4  Part: 2N7002  Type: N-Ch  PackageDescription: SOT23  [SOT-23-3 TO-236AB 2N7002]  (hidden comment: NMOS 2N7002)
R26  value 150  Tolerance: 5%  PackageDescription: 0603  PowerDisipated: 100mW  [RES 0603_1608]  (hidden comment: Res_0603_150_5%_100mW)
R27  value 150  Tolerance: 5%  PackageDescription: 0603  PowerDisipated: 100mW  [RES 0603_1608]  (hidden comment: Res_0603_150_5%_100mW)
R28  value 150  Tolerance: 5%  PackageDescription: 0603  PowerDisipated: 100mW  [RES 0603_1608]  (hidden comment: Res_0603_150_5%_100mW)
R29  value 150  Tolerance: 5%  PackageDescription: 0603  PowerDisipated: 100mW  [RES 0603_1608]  (hidden comment: Res_0603_150_5%_100mW)
RTS  Test Point Pad dual sided  [TEST POINT PAD]  (value not drawn)  (no BOM)
RXD  Test Point Pad dual sided  [TEST POINT PAD]  (value not drawn)  (no BOM)
TXD  Test Point Pad dual sided  [TEST POINT PAD]  (value not drawn)  (no BOM)
U9  Type: USB to UART  PackageDescription: SOP-16  [SSOP-16 150mil CH340C]  (hidden comment: CH340C)

### Nets
3V3: C30.2 U9.4(V3) U9.16(VCC)
GND: C30.1 D8.2 D9.2 D10.2 D11.2 U9.1(GND)
~{DTR}: DTR.1 Q3.1(G) Q4.2(S) R27.2 U9.13(~{DTR})
ENABLE_MCU: Q3.3(D)
ESD_D_N: U9.6(UD-)
ESD_D_P: U9.5(UD+)
GPIO0: Q4.3(D)
~{RTS}: Q3.2(S) Q4.1(G) R26.2 RTS.1 U9.14(~{RTS})
RXD: R29.2 RXD.1 U9.3(RXD)
TXD: R28.2 TXD.1 U9.2(TXD)
NetD8_1: D8.1 R26.1
NetD9_1: D9.1 R27.1
NetD10_1: D10.1 R28.1
NetD11_1: D11.1 R29.1

Not connected (* = marked no-connect by the designer): U9 7(NC)* 8(NC)* 9(~{CTS}) 10(~{DSR}) 11(~{RI}) 12(~{DCD}) 15(R232)

### Notes on the sheet
- USB to UART conversion
- Auto programming circuit
- ESP32 GPIO0 is a Strapping pin. Strapping pins modify the device's boot mode during chip reset. GPIO0 is pulled up during reset by default. ENABLE_MCU is pulled up by an external pullup resistor
  When GPIO0 is HIGH, it boots from internal SPI memory, but when it's LOW the boot sequence changes to 'Download' and we can upload a program to the MCU.
  [ESP32 Datasheet, section 2.4, pages 19-20]
- Real model:
- Footprint:
- Circuit truth table
- DTR    RTS    ENABLE_MCU    GPIO0
  0      0      1             1
  0      1      1             0
  1      0      0             1
  1      1      1             1
- *(DTR, RTS active low)
- These LEDs serve as a visual testimonie of UART communication and help during debugging.
  If they drag too much current they can be used with 1 kΩ resistors or be completely disconnected.
  Should not be present on a commercial product.
- [v06 VALIDATION NOTE]
  This circuit works correcly, the programming signaling sequence (RESET to Low, then GPIO0 to low) is correct and we can program the MCU.
- [v06 VALIDATION NOTE]
  This IC works correctly. However, debug LEDs are both not very visible (they blink fast for short times) and not very useful (sometimes redundant), so they can be removed.
- Designer's signature
- Sheet title:
- Sr. Andrés Roldán Aranda
- Supervisor:
- Supervisor's signature
- Project title:
- Desginer:
- Dpto. Electrónica y Tecnología
- de Computadores
- University of Granada
- C/ Fuente Nueva, s/n, 18001
- Granada, Granada, Spain
- Date:
- Revision:
- Sheet
- of
- (in symbol Test Point Pad dual sided) i

### Library data of the parts
C30 = Cap_cer_0805_100nF_10%: Ceramic cap size 0805; FabGroup: USB to UART & Programming; FabOrder: 3
D8 D10 = Diode LED_G_0805: Low power LED color Green; FabGroup: USB to UART & Programming; FabOrder: 3
D9 D11 = Diode LED_R_0805: Low power LED color Red; FabGroup: USB to UART & Programming; FabOrder: 3
DTR RTS RXD TXD = Test Point Pad dual sided: Test point - PCB Pad dual sided
Q3 Q4 = NMOS 2N7002: FabGroup: USB to UART & Programming; FabOrder: 3; Value: *
R26-R29 = Res_0603_150_5%_100mW: Res size 0603 SMD mounting, low power
U9 = IC CH340C usb to ttl: USB to serial chip CH340C, integrated oscillator.; FabGroup: USB to UART & Programming; FabOrder: 3; Part: CH340C

## Sheet tft_lcd_display.SchDoc: LCD TFT touchscreen & SD card reader
size A4; SheetNumber: 15; SheetTotal: 20; TitleBig: LCD TFT touchscreen & SD card reader; Desc_line1: TIK uses an ILI9341 2.8" TFT LCD display module as a graphic user interface. This module has touchscreen; Desc_line2: capabilities and also integrates a SD card reader on one of its sides. All three elements are managed via SPI.
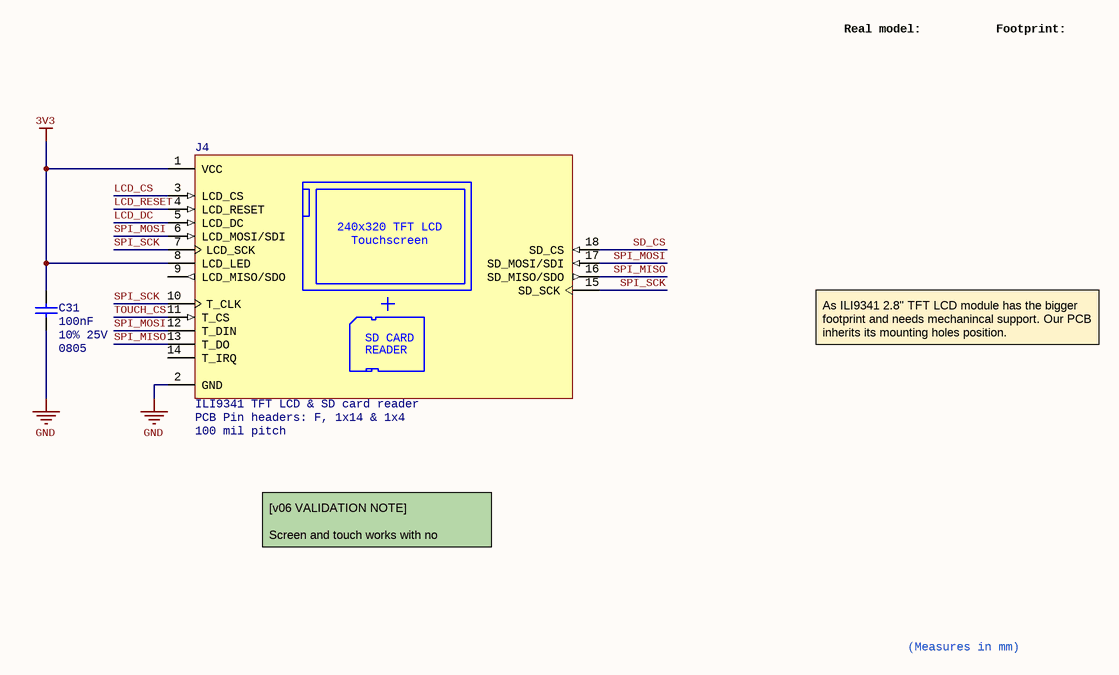
[diagram p16: tft_lcd_display.SchDoc]

### Parts
C31  value 100nF  Tolerance: 10% 25V  PackageDescription: 0805  [CAP 0805_2012]  (hidden comment: Cap_cer_0805)
J4  Part: ILI9341 TFT LCD & SD card reader  Type: PCB Pin headers: F, 1x14 & 1x4  PackageDescription: 100 mil pitch  [ILI9341 2.8" TFT LCD + SD CARD]  (hidden comment: ILI9341 TFT LCD)

### Nets
3V3: C31.2 J4.1(VCC) J4.8(LCD_LED)
GND: C31.1 J4.2(GND)
LCD_CS: J4.3(LCD_CS)
LCD_DC: J4.5(LCD_DC)
LCD_RESET: J4.4(LCD_RESET)
SD_CS: J4.18(SD_CS)
SPI_MISO: J4.13(T_DO) J4.16(SD_MISO/SDO)
SPI_MOSI: J4.6(LCD_MOSI/SDI) J4.12(T_DIN) J4.17(SD_MOSI/SDI)
SPI_SCK: J4.7(LCD_SCK) J4.10(T_CLK) J4.15(SD_SCK)
TOUCH_CS: J4.11(T_CS)

Not connected (* = marked no-connect by the designer): J4 9(LCD_MISO/SDO) 14(T_IRQ)

### Notes on the sheet
- Real model:
- Footprint:
- As ILI9341 2.8" TFT LCD module has the bigger footprint and needs mechanincal support. Our PCB inherits its mounting holes position.
- [v06 VALIDATION NOTE]
  Screen and touch works with no problems.
- (Measures in mm)
- Designer's signature
- Sheet title:
- Sr. Andrés Roldán Aranda
- Supervisor:
- Supervisor's signature
- Project title:
- Desginer:
- Dpto. Electrónica y Tecnología
- de Computadores
- University of Granada
- C/ Fuente Nueva, s/n, 18001
- Granada, Granada, Spain
- Date:
- Revision:
- Sheet
- of
- (in symbol MOD ILI9341 TFT LCD + SD CARD READER) 240x320 TFT LCD; Touchscreen; SD CARD; READER

### Library data of the parts
C31 = Cap_cer_0805_100nF_10%: Ceramic cap size 0805; FabGroup: LCD TFT Display; FabOrder: 15
J4 = MOD ILI9341 TFT LCD + SD CARD READER: ILI9341 TFT LCD Jumper pin headers., plus SD card reader pins; FabGroup: LCD TFT Display; FabOrder: 15

## Sheet HX711_load_cell_amplifier.SchDoc: HX711 load cell amplifier
size A4; SheetNumber: 19; SheetTotal: 20; TitleBig: HX711 load cell amplifier; Desc_line1: This circuit is used to get weight measurements out from load cells in order to estimate the density of a trunk or board.; Desc_line2: This design is based on the Sparkfun HX711 module by N. Seidle and A. Wende.
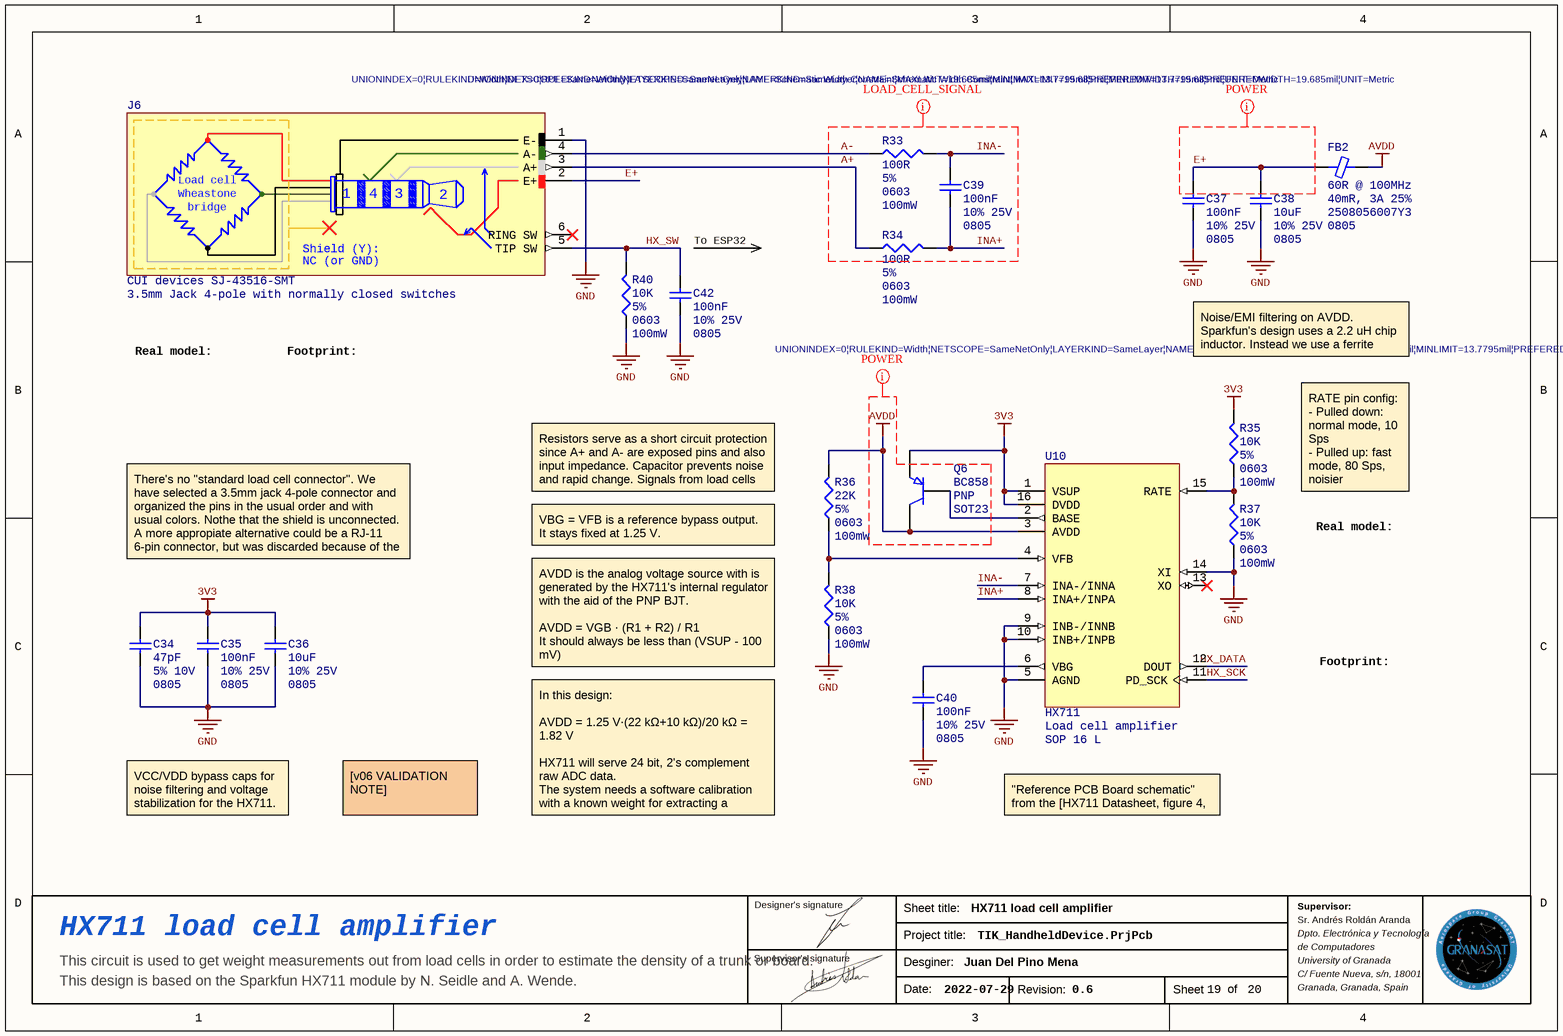
[diagram p17: HX711_load_cell_amplifier.SchDoc]

### Parts
C34  value 47pF  Tolerance: 5% 10V  PackageDescription: 0805  [CAP 0805_2012]  (hidden comment: Cap_cer_0805)
C35  value 100nF  Tolerance: 10% 25V  PackageDescription: 0805  [CAP 0805_2012]  (hidden comment: Cap_cer_0805)
C36  value 10uF  Tolerance: 10% 25V  PackageDescription: 0805  [CAP 0805_2012]  (hidden comment: Cap_cer_0805)
C37  value 100nF  Tolerance: 10% 25V  PackageDescription: 0805  [CAP 0805_2012]  (hidden comment: Cap_cer_0805)
C38  value 10uF  Tolerance: 10% 25V  PackageDescription: 0805  [CAP 0805_2012]  (hidden comment: Cap_cer_0805)
C39  value 100nF  Tolerance: 10% 25V  PackageDescription: 0805  [CAP 0805_2012]  (hidden comment: Cap_cer_0805)
C40  value 100nF  Tolerance: 10% 25V  PackageDescription: 0805  [CAP 0805_2012]  (hidden comment: Cap_cer_0805)
C42  value 100nF  Tolerance: 10% 25V  PackageDescription: 0805  [CAP 0805_2012]  (hidden comment: Cap_cer_0805)
FB2  value 40mR, 3A 25%  Desc: 60R @ 100MHz  Part: 2508056007Y3  PackageDescription: 0805  [FER 0805_2012]  (hidden comment: Ferrite Bead Chip Fair-Rite 2508056007Y3)
J6  Part: CUI devices SJ-43516-SMT  [JACK_6_CONN_CUI_DEVICES_SJ-43516-SMT]  (hidden comment: CON LOAD CELL PORT JACK)
Q6  Part: BC858  Type: PNP  PackageDescription: SOT23  [SOT-23-3 TO-236AB BC858]  (hidden comment: PNP BJT BC858 transistor)
R33  value 100R  Tolerance: 5%  PackageDescription: 0603  PowerDisipated: 100mW  [RES 0603_1608]  (hidden comment: Res_0603_100R_5%_100mW)
R34  value 100R  Tolerance: 5%  PackageDescription: 0603  PowerDisipated: 100mW  [RES 0603_1608]  (hidden comment: Res_0603_100R_5%_100mW)
R35  value 10K  Tolerance: 5%  PackageDescription: 0603  PowerDisipated: 100mW  [RES 0603_1608]  (hidden comment: Res_0603_10K_5%_100mW_1)
R36  value 22K  Tolerance: 5%  PackageDescription: 0603  PowerDisipated: 100mW  [RES 0603_1608]  (hidden comment: Res_0603_22K_5%_100mW)
R37  value 10K  Tolerance: 5%  PackageDescription: 0603  PowerDisipated: 100mW  [RES 0603_1608]  (hidden comment: Res_0603_10K_5%_100mW_1)
R38  value 10K  Tolerance: 5%  PackageDescription: 0603  PowerDisipated: 100mW  [RES 0603_1608]  (hidden comment: Res_0603_10K_5%_100mW_1)
R40  value 10K  Tolerance: 5%  PackageDescription: 0603  PowerDisipated: 100mW  [RES 0603_1608]  (hidden comment: Res_0603_10K_5%_100mW_1)
U10  Part: HX711  Desc: Load cell amplifier  PackageDescription: SOP 16 L  [SOP-16 L HX711]  (hidden comment: IC HX711 load cell amp)

### Nets
3V3: C34.2 C35.2 C36.2 Q6.2(E) R35.2 U10.1(VSUP) U10.16(DVDD)
AVDD: FB2.2 Q6.3(C) R36.2 U10.3(AVDD)
GND: C34.1 C35.1 C36.1 C37.1 C38.1 C40.1 C42.1 J6.1(E-) R37.1 R38.1 R40.1 U10.5(AGND) U10.9(INB-/INNB) U10.10(INB+/INPB) U10.14(XI)
A+: J6.3(A+) R34.1
A-: J6.4(A-) R33.1
E+: C37.2 C38.2 FB2.1 J6.2(E+)
HX_DATA: U10.12(DOUT)
HX_SCK: U10.11(PD_SCK)
HX_SW: C42.2 J6.5(TIP_SW) R40.2
INA+: C39.1 R34.2 U10.8(INA+/INPA)
INA-: C39.2 R33.2 U10.7(INA-/INNA)
NetC40_2: C40.2 U10.6(VBG)
NetQ6_1: Q6.1(B) U10.2(BASE)
NetR35_1: R35.1 R37.2 U10.15(RATE)
NetR36_1: R36.1 R38.2 U10.4(VFB)

Not connected (* = marked no-connect by the designer): J6 6(RING_SW)*; U10 13(XO)*

### Layout directives
net class POWER; rule Width Constraint [Pref Width = 0.5mm    Min Width = 0.35mm    Max Width = 0.5mm]: AVDD, E+
net class LOAD_CELL_SIGNAL; rule Width Constraint [Pref Width = 0.5mm    Min Width = 0.35mm    Max Width = 0.5mm]: A+, A-, INA+, INA-

### Notes on the sheet
- (near C42) To ESP32
- Real model:
- Footprint:
- Noise/EMI filtering on AVDD. Sparkfun's design uses a 2.2 uH chip inductor. Instead we use a ferrite bead.
- Resistors serve as a short circuit protection since A+ and A- are exposed pins and also input impedance. Capacitor prevents noise and rapid change. Signals from load cells are slow.
- RATE pin config:
  - Pulled down: normal mode, 10 Sps
  - Pulled up: fast mode, 80 Sps, noisier
- There's no "standard load cell connector". We have selected a 3.5mm jack 4-pole connector and organized the pins in the usual order and with usual colors. Nothe that the shield is unconnected. A more appropiate alternative could be a RJ-11 6-pin connector, but was discarded because of the large socket size.
- VBG = VFB is a reference bypass output. It stays fixed at 1.25 V.
- AVDD is the analog voltage source with is generated by the HX711's internal regulator with the aid of the PNP BJT.
  AVDD = VGB · (R1 + R2) / R1
  It should always be less than (VSUP - 100 mV)
  [HX711 datasheet, page 4]
- VCC/VDD bypass caps for noise filtering and voltage stabilization for the HX711.
- [v06 VALIDATION NOTE]
  UNTESTED
- In this design:
  AVDD = 1.25 V·(22 kΩ+10 kΩ)/20 kΩ = 1.82 V
  HX711 will serve 24 bit, 2's complement raw ADC data.
  The system needs a software calibration with a known weight for extracting a correction factor for this design.
- "Reference PCB Board schematic" from the [HX711 Datasheet, figure 4, page 6]
- Designer's signature
- Sheet title:
- Sr. Andrés Roldán Aranda
- Supervisor:
- Supervisor's signature
- Project title:
- Desginer:
- Dpto. Electrónica y Tecnología
- de Computadores
- University of Granada
- C/ Fuente Nueva, s/n, 18001
- Granada, Granada, Spain
- Date:
- Revision:
- Sheet
- of
- (in symbol CON LOAD CELL PORT JACK) Load cell; Wheastone; bridge; Shield (Y):; NC (or GND)

### Library data of the parts
C34 = Cap_cer_0805_47pF_5%: Ceramic cap size 0805
C35 C37 C39 C40 C42 = Cap_cer_0805_100nF_10%: Ceramic cap size 0805
C36 C38 = Cap_cer_0805_10uF_10%: Ceramic cap size 0805
FB2 = Ferrite Bead Chip Fair-Rite 2508056007Y3: 0805, 60Ω, 3A, 25% SMT
J6 = CON LOAD CELL PORT JACK: 3.5mm Jack 4-pole with normally closed switches; PackageDescription: 3.5mm Jack 4-pole with normally closed switches
Q6 = PNP BJT BC858 transistor: 65 V, 100 mA PNP general-purpose transistor
R33 R34 = Res_0603_100R_5%_100mW: Res size 0603 SMD mounting, low power
R35 R37 R38 R40 = Res_0603_10K_5%_100mW_1: Res size 0603 SMD mounting, low power
R36 = Res_0603_22K_5%_100mW: Res size 0603 SMD mounting, low power
U10 = IC HX711 load cell amp: HX711 load cell amplifier

## Sheet expansion_port.SchDoc: Expansion port
size A4; Date: 2022-07-29; Revision: 0.6; SheetNumber: 18; SheetTotal: 20; TitleBig: Expansion port & jack connector; Desc_line1: Expansion port for added functionality, such as an ultrasould resonance analysis for wood boards.; Desc_line2: Also, this sheet includes a description of the jack connector properties.
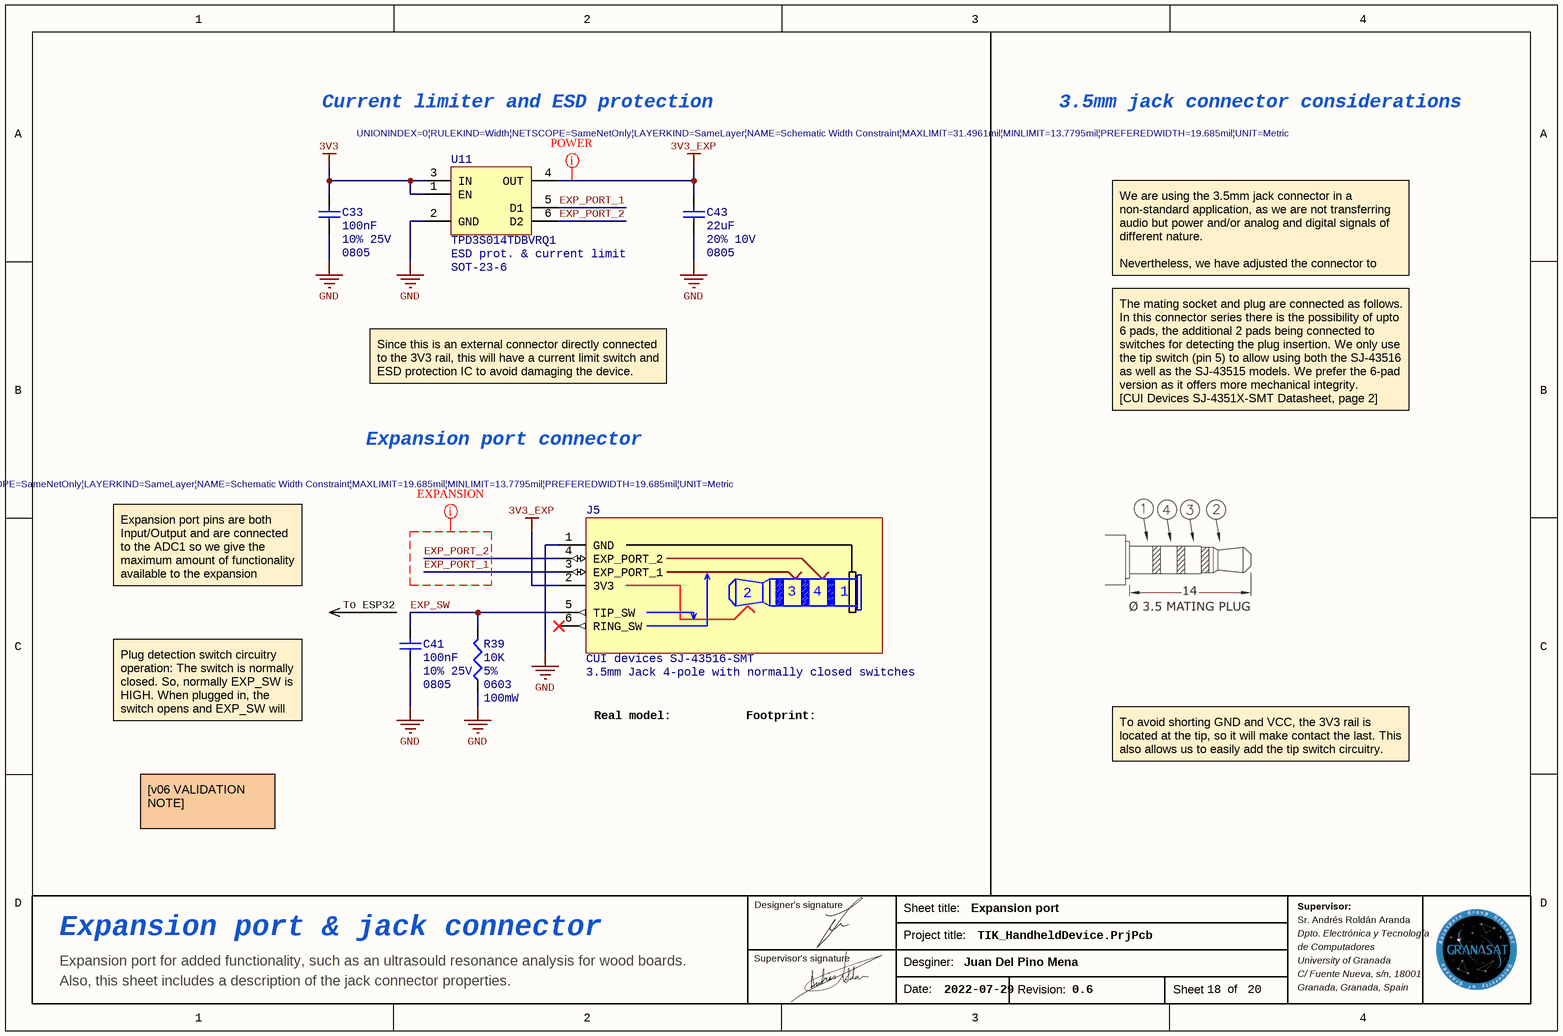
[diagram p18: expansion_port.SchDoc]

### Parts
C33  value 100nF  Tolerance: 10% 25V  PackageDescription: 0805  [CAP 0805_2012]  (hidden comment: Cap_cer_0805)
C41  value 100nF  Tolerance: 10% 25V  PackageDescription: 0805  [CAP 0805_2012]  (hidden comment: Cap_cer_0805)
C43  value 22uF  Tolerance: 20% 10V  PackageDescription: 0805  [CAP 0805_2012]  (hidden comment: Cap_cer_0805)
J5  Part: CUI devices SJ-43516-SMT  [JACK_6_CONN_CUI_DEVICES_SJ-43516-SMT]  (hidden comment: CON EXPANSION_PORT)
R39  value 10K  Tolerance: 5%  PackageDescription: 0603  PowerDisipated: 100mW  [RES 0603_1608]  (hidden comment: Res_0603_10K_5%_100mW_1)
U11  Part: TPD3S014TDBVRQ1  PackageDescription: SOT-23-6  Desc: ESD prot. & current limit  [TSOT-23-6 TPD3S014TDBVRQ1]  (hidden comment: IC TPD3S014 Current switch)

### Nets
3V3: C33.2 U11.1(EN) U11.3(IN)
3V3_EXP: C43.2 J5.2(3V3) U11.4(OUT)
GND: C33.1 C41.1 C43.1 J5.1(GND) R39.1 U11.2(GND)
EXP_PORT_1: J5.3(EXP_PORT_1) U11.5(D1)
EXP_PORT_2: J5.4(EXP_PORT_2) U11.6(D2)
EXP_SW: C41.2 J5.5(TIP_SW) R39.2

Not connected (* = marked no-connect by the designer): J5 6(RING_SW)*

### Layout directives
net class EXPANSION; rule Width Constraint [Pref Width = 0.5mm    Min Width = 0.35mm    Max Width = 0.5mm]: EXP_PORT_1, EXP_PORT_2
net class POWER; rule Width Constraint [Pref Width = 0.5mm    Min Width = 0.35mm    Max Width = 0.8mm]: 3V3_EXP

### Notes on the sheet
- Current limiter and ESD protection
- 3.5mm jack connector considerations
- We are using the 3.5mm jack connector in a non-standard application, as we are not transferring audio but power and/or analog and digital signals of different nature.
  Nevertheless, we have adjusted the connector to somewhat fit the OMPT convention (GND in sleeve, signals in rings).
- Since this is an external connector directly connected to the 3V3 rail, this will have a current limit switch and ESD protection IC to avoid damaging the device.
- Expansion port connector
- The mating socket and plug are connected as follows.
  In this connector series there is the possibility of upto 6 pads, the additional 2 pads being connected to switches for detecting the plug insertion. We only use the tip switch (pin 5) to allow using both the SJ-43516 as well as the SJ-43515 models. We prefer the 6-pad version as it offers more mechanical integrity.
  [CUI Devices SJ-4351X-SMT Datasheet, page 2]
- Expansion port pins are both Input/Output and are connected to the ADC1 so we give the maximum amount of functionality available to the expansion module.
- (near C41) To ESP32
- Plug detection switch circuitry operation: The switch is normally closed. So, normally EXP_SW is HIGH. When plugged in, the switch opens and EXP_SW will be LOW
- Real model:
- Footprint:
- To avoid shorting GND and VCC, the 3V3 rail is located at the tip, so it will make contact the last. This also allows us to easily add the tip switch circuitry.
- [v06 VALIDATION NOTE]
  UNTESTED
- Designer's signature
- Sheet title:
- Sr. Andrés Roldán Aranda
- Supervisor:
- Supervisor's signature
- Project title:
- Desginer:
- Dpto. Electrónica y Tecnología
- de Computadores
- University of Granada
- C/ Fuente Nueva, s/n, 18001
- Granada, Granada, Spain
- Date:
- Revision:
- Sheet
- of

### Library data of the parts
C33 C41 = Cap_cer_0805_100nF_10%: Ceramic cap size 0805
C43 = Cap_cer_0805_22uF_20%: Ceramic cap size 0805 CC0805MKX5R6BB226 Yageo MLCC 22uF 10V 20% X5R
J5 = CON EXPANSION_PORT: 3.5mm Jack 4-pole with normally closed switches; Desc: 3.5mm Jack 4-pole with normally closed switches
R39 = Res_0603_10K_5%_100mW_1: Res size 0603 SMD mounting, low power
U11 = IC TPD3S014 Current switch: TPD3S014TDBVRQ1 ESD prot. & current limit

## Sheet power_budget.SchDoc: Power budget and battery selection
size A4; SheetNumber: 20; SheetTotal: 20; TitleBig: Power budget and battery selection; Desc_line1: Detailed estimation of typical and worst-case power consumption per component in order to define battery; Desc_line2: requirements. Choosing an adequate battery.
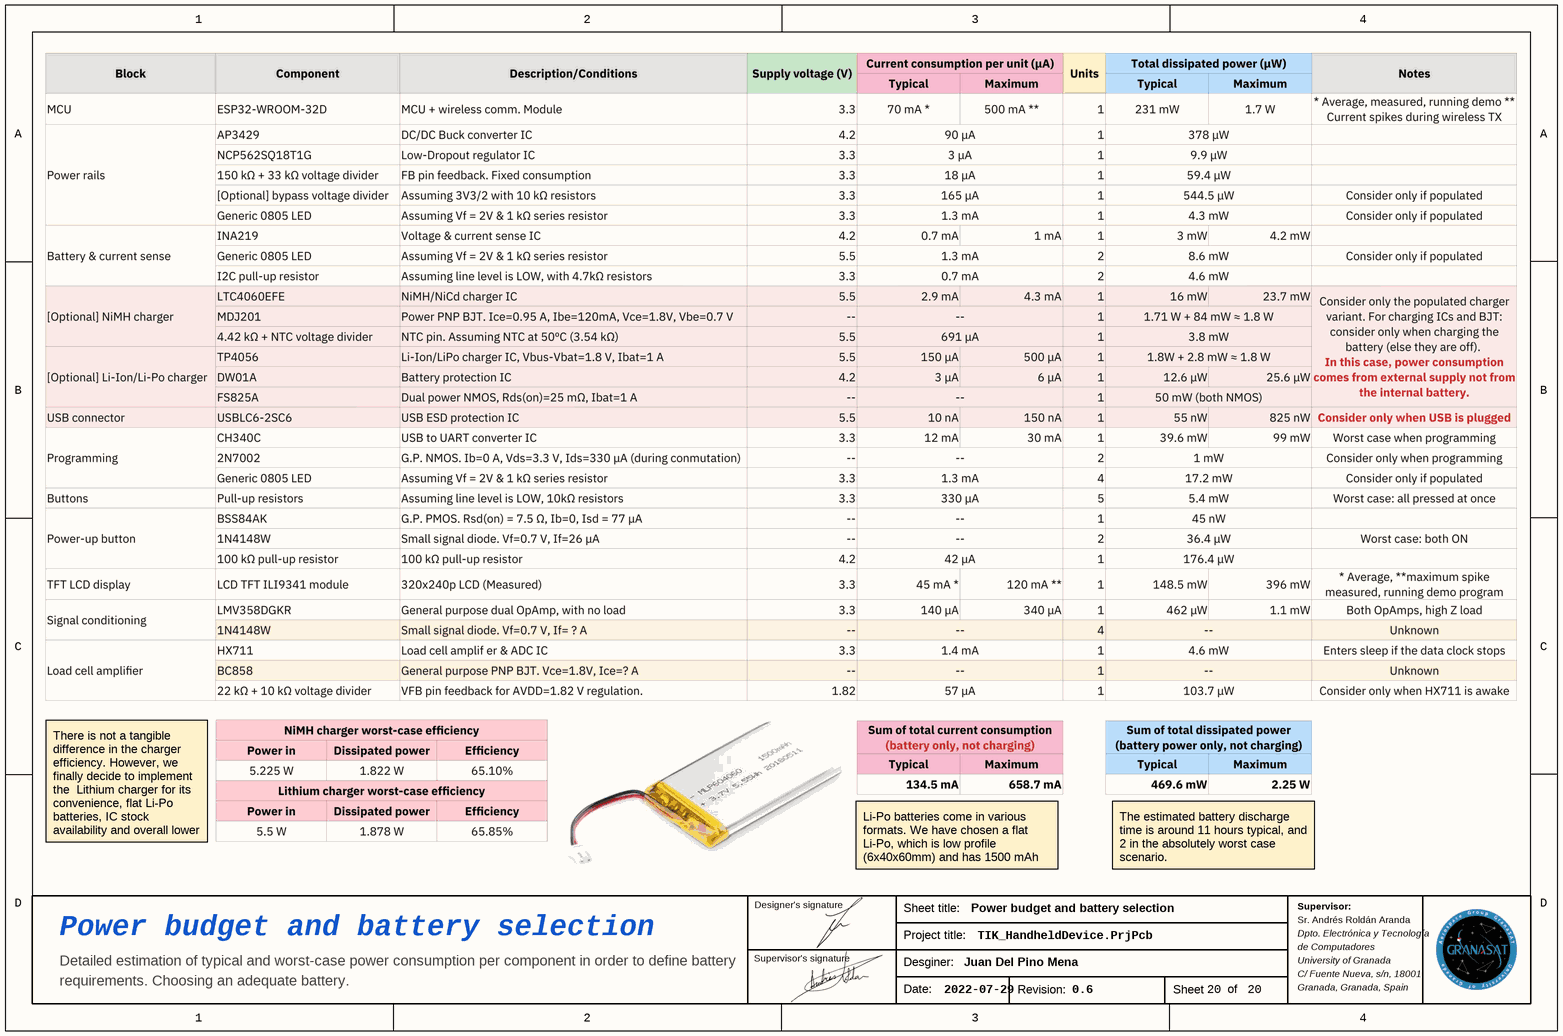
[diagram p19: power_budget.SchDoc]

### Notes on the sheet
- There is not a tangible difference in the charger efficiency. However, we finally decide to implement the  Lithium charger for its convenience, flat Li-Po batteries, IC stock availability and overall lower price.
- Li-Po batteries come in various formats. We have chosen a flat Li-Po, which is low profile (6x40x60mm) and has 1500 mAh (approx 5.5 Wh) of energy.
- The estimated battery discharge time is around 11 hours typical, and 2 in the absolutely worst case scenario.
- Designer's signature
- Sheet title:
- Sr. Andrés Roldán Aranda
- Supervisor:
- Supervisor's signature
- Project title:
- Desginer:
- Dpto. Electrónica y Tecnología
- de Computadores
- University of Granada
- C/ Fuente Nueva, s/n, 18001
- Granada, Granada, Spain
- Date:
- Revision:
- Sheet
- of

## Nets that join several sheets
3V3: esp32_mcu (6 pins), power_rails (12 pins), buttons (5 pins), signal_conditioning_circuit (C26.2 C27.2 U6.8), battery_and_current_sense (R21.2 R22.2), programming (C30.2 U9.4 U9.16), tft_lcd_display (C31.2 J4.1 J4.8), HX711_load_cell_amplifier (7 pins), expansion_port (C33.2 U11.1 U11.3)
BAT-: battery_and_current_sense (BAT1.1 C29.1 R25.2), battery_charger_li-ion (C15.1 Q1.6 Q1.7 U3.6)
GND: block_diagram (GND1.1 GND2.1 GND3.1 GND4.1), esp32_mcu (8 pins), power_rails (14 pins), usb_port (C17.1 J1.5 U5.2), buttons (8 pins), powerup_button (C32.1 R31.1 R32.1 S4.1), signal_conditioning_circuit (C26.1 C27.1 U6.4), battery_and_current_sense (5 pins), battery_charger_ni_mh (6 pins), battery_charger_li-ion (6 pins), programming (6 pins), tft_lcd_display (C31.1 J4.2), HX711_load_cell_amplifier (15 pins), expansion_port (6 pins)
VBIAS: power_rails (6 pins), signal_conditioning_circuit (13 pins)
VMEAS: power_rails (C9.2 U1.4), powerup_button (Q5.2 R30.2), battery_and_current_sense (MEAS.1 R20.2 U8.7), battery_charger_ni_mh (Q2.4 U7.2), battery_charger_li-ion (R6.2 U4.5)
VUSB: usb_port (C17.2 FB1.2 U5.5 VUSB.1), battery_and_current_sense (D6.1 D7.1), battery_charger_ni_mh (5 pins), battery_charger_li-ion (C16.2 U4.4 U4.8)
BAT_CHRG: esp32_mcu (MCU1.27), battery_and_current_sense (CHRG.1 R23.1), battery_charger_ni_mh (U7.15), battery_charger_li-ion (U4.7)
BAT_STBY: esp32_mcu (MCU1.28), battery_and_current_sense (R24.1 STBY.1), battery_charger_ni_mh (U7.13), battery_charger_li-ion (U4.6)
EMITTER_AMP: esp32_mcu (MCU1.4), signal_conditioning_circuit (C22.2 E_AMP.1 R14.2 U6.1)
ENABLE_DCDC: power_rails (EN_DCDC.1 U1.1), powerup_button (D12.2 D13.2 R32.2)
ENABLE_MCU: esp32_mcu (MCU1.3), buttons (5 pins), programming (Q3.3)
ESD_D_N: usb_port (U5.6), programming (U9.6)
ESD_D_P: usb_port (U5.4), programming (U9.5)
EXP_PORT_1: esp32_mcu (MCU1.8), expansion_port (J5.3 U11.5)
EXP_PORT_2: esp32_mcu (MCU1.9), expansion_port (J5.4 U11.6)
EXP_SW: esp32_mcu (MCU1.22), expansion_port (C41.2 J5.5 R39.2)
GPIO0: esp32_mcu (MCU1.25), buttons (C20.2 GPIO0.1 R13.1 S3.2), programming (Q4.3)
HX_DATA: esp32_mcu (MCU1.7), HX711_load_cell_amplifier (U10.12)
HX_SCK: esp32_mcu (MCU1.10), HX711_load_cell_amplifier (U10.11)
HX_SW: esp32_mcu (MCU1.20), HX711_load_cell_amplifier (C42.2 J6.5 R40.2)
LCD_CS: esp32_mcu (MCU1.23), tft_lcd_display (J4.3)
LCD_DC: esp32_mcu (MCU1.24), tft_lcd_display (J4.5)
LCD_RESET: esp32_mcu (MCU1.26), tft_lcd_display (J4.4)
POWER_SW_HOLD: esp32_mcu (MCU1.11), powerup_button (D13.1 PW_HOLD.1)
POWER_SW_USER: esp32_mcu (MCU1.6), powerup_button (5 pins)
RECEIVER_AMP: esp32_mcu (MCU1.5), signal_conditioning_circuit (C25.2 R17.2 R_AMP.1 U6.7)
RXD: esp32_mcu (MCU1.35), programming (R29.2 RXD.1 U9.3)
SCL: esp32_mcu (MCU1.36), battery_and_current_sense (R22.1 U8.4)
SD_CS: esp32_mcu (MCU1.29), tft_lcd_display (J4.18)
SDA: esp32_mcu (MCU1.33), battery_and_current_sense (R21.1 U8.3)
SPI_MISO: esp32_mcu (MCU1.31), tft_lcd_display (J4.13 J4.16)
SPI_MOSI: esp32_mcu (MCU1.37), tft_lcd_display (J4.6 J4.12 J4.17)
SPI_SCK: esp32_mcu (MCU1.30), tft_lcd_display (J4.7 J4.10 J4.15)
THERMISTOR: battery_and_current_sense (RT1.1), battery_charger_ni_mh (R18.1 U7.11), battery_charger_li-ion (U4.1)
THUMB_SW_CCW: esp32_mcu (MCU1.12), buttons (R9.1 S1.1)
THUMB_SW_CW: esp32_mcu (MCU1.16), buttons (R11.1 S1.2)
THUMB_SW_PUSH: esp32_mcu (MCU1.13), buttons (C21.2 R10.1 S1.T)
TOUCH_CS: esp32_mcu (MCU1.14), tft_lcd_display (J4.11)
TXD: esp32_mcu (MCU1.34), programming (R28.2 TXD.1 U9.2)